# EAGLE design range_cape (EAGLE 7.1.0)

## Sheet 1 of 5
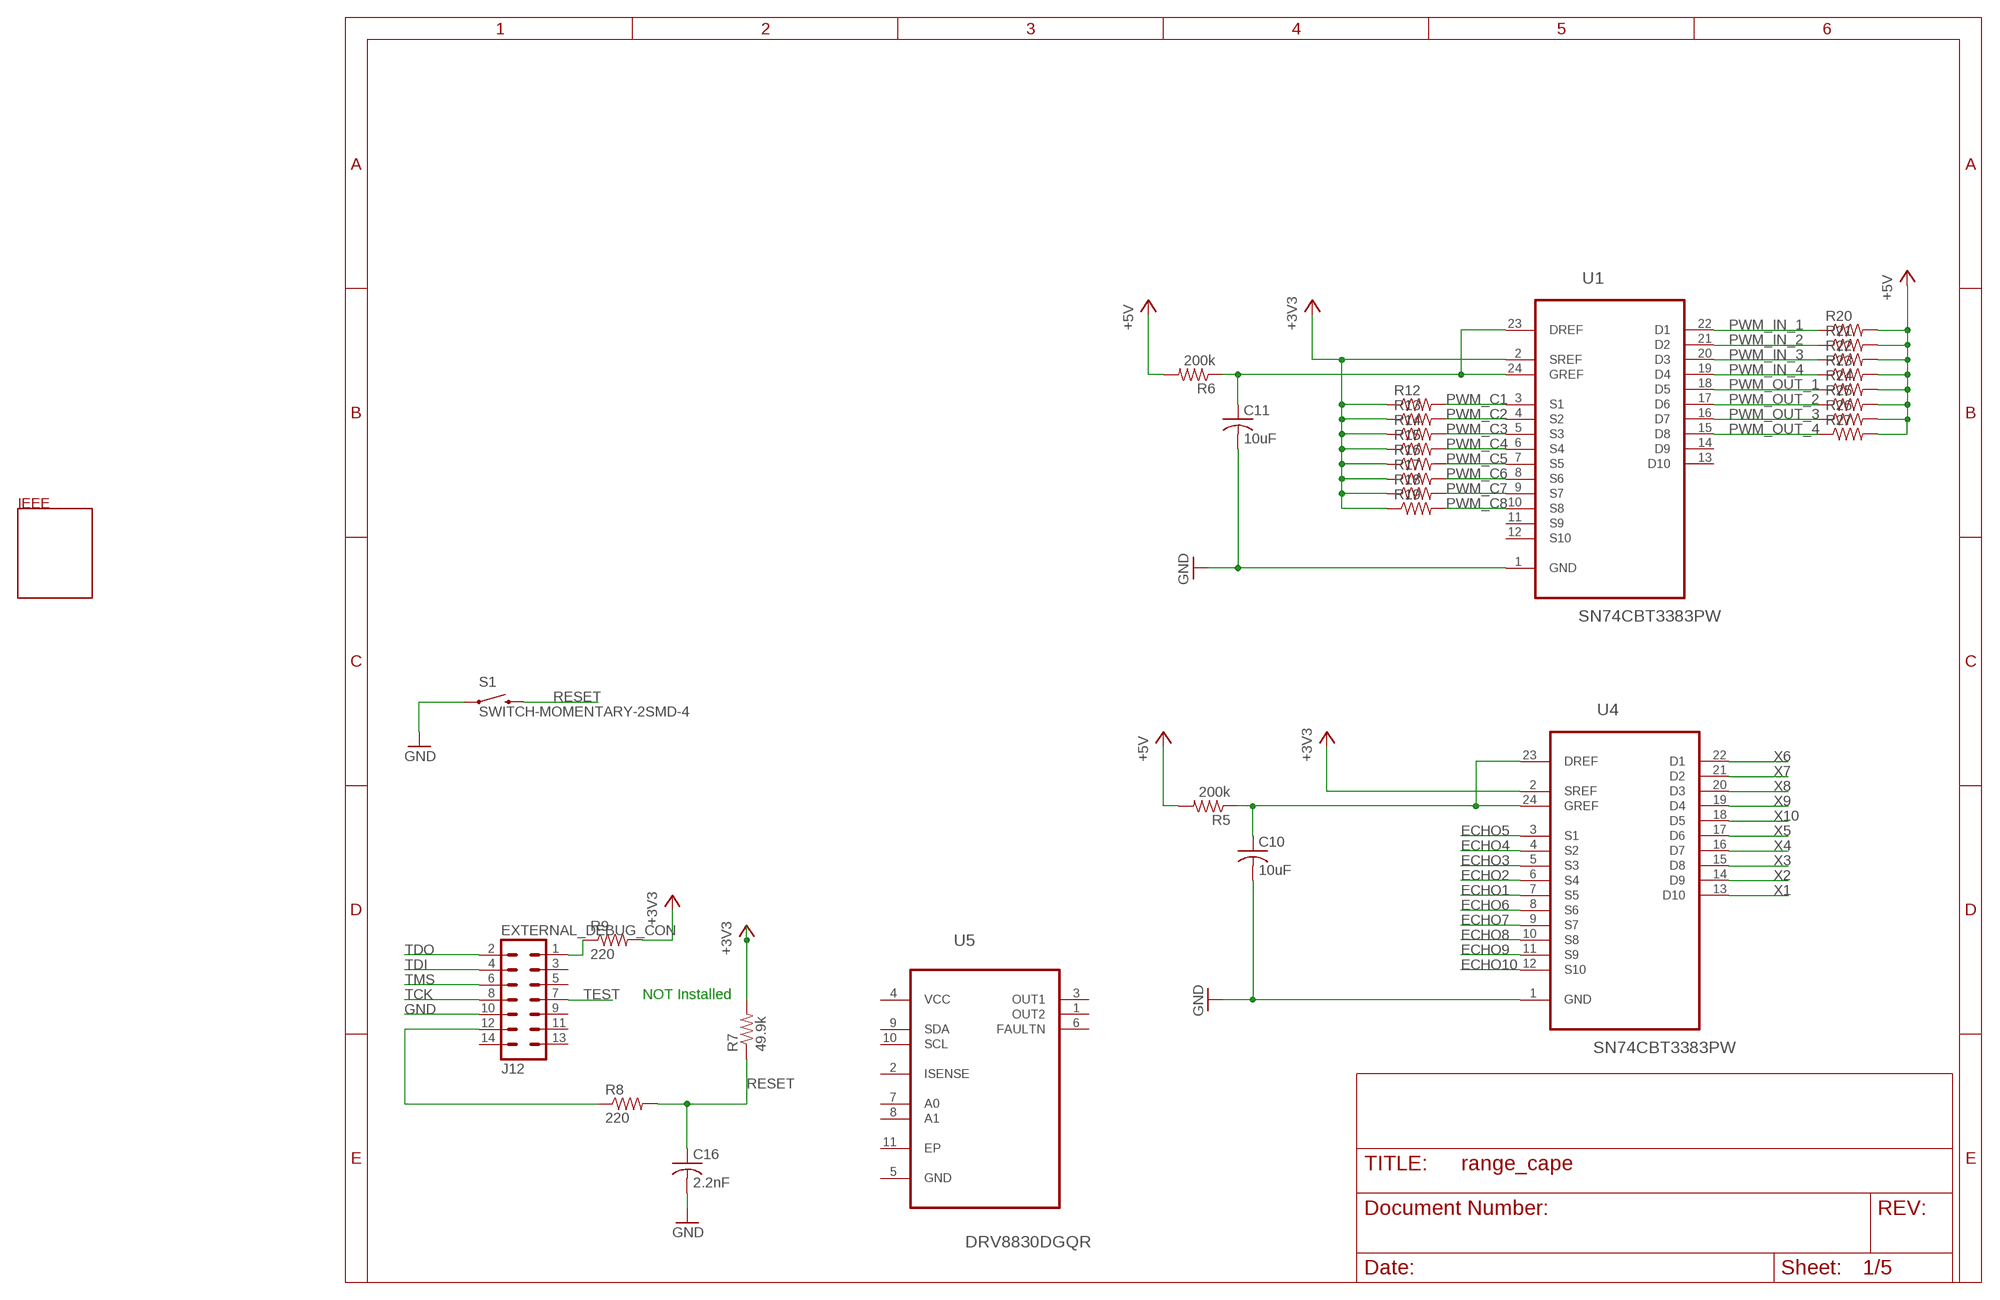
[diagram p0: schematic, sheet 1]

### Parts
C10  10uF  C-USC0805  [C0805]
C11  10uF  C-USC0805  [C0805]
C16  2.2nF  C-USC0603  [C0603]
J12  EXTERNAL_DEBUG_CON  [EXTERNAL_DEBUG]
R5  200k  R-US_R0603  [R0603]
R6  200k  R-US_R0603  [R0603]
R7  49.9k  R-US_R0603  [R0603]
R8  220  R-US_R0603  [R0603]
R9  220  R-US_R0603  [R0603]
R12  R-US_R0402  [R0402]
R13  R-US_R0402  [R0402]
R14  R-US_R0402  [R0402]
R15  R-US_R0402  [R0402]
R16  R-US_R0402  [R0402]
R17  R-US_R0402  [R0402]
R18  R-US_R0402  [R0402]
R19  R-US_R0402  [R0402]
R20  R-US_R0402  [R0402]
R21  R-US_R0402  [R0402]
R22  R-US_R0402  [R0402]
R23  R-US_R0402  [R0402]
R24  R-US_R0402  [R0402]
R25  R-US_R0402  [R0402]
R26  R-US_R0402  [R0402]
R27  R-US_R0402  [R0402]
S1  SWITCH-MOMENTARY-2SMD-4  [TACTILE_SWITCH_TALL]
U1  SN74CBT3383PW  [SOP65P640X120-24N]
U4  SN74CBT3383PW  [SOP65P640X120-24N]
U5  DRV8830DGQR  [SOP65P640X110-15N]
U$2  IEEE  [IEEE]

### Nets
+3V3: R7.2 R9.2 R12.1 R13.1 R14.1 R15.1 R16.1 R17.1 R18.1 R19.1 U1.2(SREF) U4.2(SREF) ; also sheet 2,4
+5V: R5.2 R6.2 R20.2 R21.2 R22.2 R23.2 R24.2 R25.2 R26.2 R27.2 ; also sheet 2,3,4
ECHO1: U4.7(S5)
ECHO2: U4.6(S4)
ECHO3: U4.5(S3)
ECHO4: U4.4(S2)
ECHO5: U4.3(S1)
ECHO6: U4.8(S6)
ECHO7: U4.9(S7)
ECHO8: U4.10(S8)
ECHO9: U4.11(S9)
ECHO10: U4.12(S10)
GND: C10.2 C11.2 C16.2 J12.10 S1.A2 U1.1(GND) U4.1(GND) ; also sheet 2,3,4,5
N$4: C11.1 R6.1 U1.23(DREF) U1.24(GREF)
N$8: J12.12 R8.1
N$9: J12.1 R9.1
N$12: C10.1 R5.1 U4.23(DREF) U4.24(GREF)
PWM_C1: R12.2 U1.3(S1)
PWM_C2: R13.2 U1.4(S2)
PWM_C3: R14.2 U1.5(S3)
PWM_C4: R15.2 U1.6(S4)
PWM_C5: R16.2 U1.7(S5)
PWM_C6: R17.2 U1.8(S6)
PWM_C7: R18.2 U1.9(S7)
PWM_C8: R19.2 U1.10(S8)
PWM_IN_1: R20.1 U1.22(D1) ; also sheet 3
PWM_IN_2: R21.1 U1.21(D2) ; also sheet 3
PWM_IN_3: R22.1 U1.20(D3) ; also sheet 3
PWM_IN_4: R23.1 U1.19(D4) ; also sheet 3
PWM_OUT_1: R24.1 U1.18(D5) ; also sheet 3
PWM_OUT_2: R25.1 U1.17(D6) ; also sheet 3
PWM_OUT_3: R26.1 U1.16(D7) ; also sheet 3
PWM_OUT_4: R27.1 U1.15(D8) ; also sheet 3
RESET: C16.1 R7.1 R8.2 S1.B2
TCK: J12.8
TDI: J12.4
TDO: J12.2
TEST: J12.7
TMS: J12.6
X1: U4.13(D10) ; also sheet 3
X2: U4.14(D9) ; also sheet 3
X3: U4.15(D8) ; also sheet 3
X4: U4.16(D7) ; also sheet 3
X5: U4.17(D6) ; also sheet 3
X6: U4.22(D1) ; also sheet 3
X7: U4.21(D2) ; also sheet 3
X8: U4.20(D3) ; also sheet 3
X9: U4.19(D4) ; also sheet 3
X10: U4.18(D5) ; also sheet 3
Unconnected: J12.3 J12.5 J12.9 J12.11 J12.13 J12.14 U1.11(S9) U1.12(S10) U1.13(D10) U1.14(D9) U5.1(OUT2) U5.2(ISENSE) U5.3(OUT1) U5.5(GND) U5.6(FAULTN) U5.7(A0) U5.8(A1) U5.9(SDA) U5.10(SCL) U5.11(EP)

### Notes on the sheet
- NOT Installed

## Sheet 2 of 5
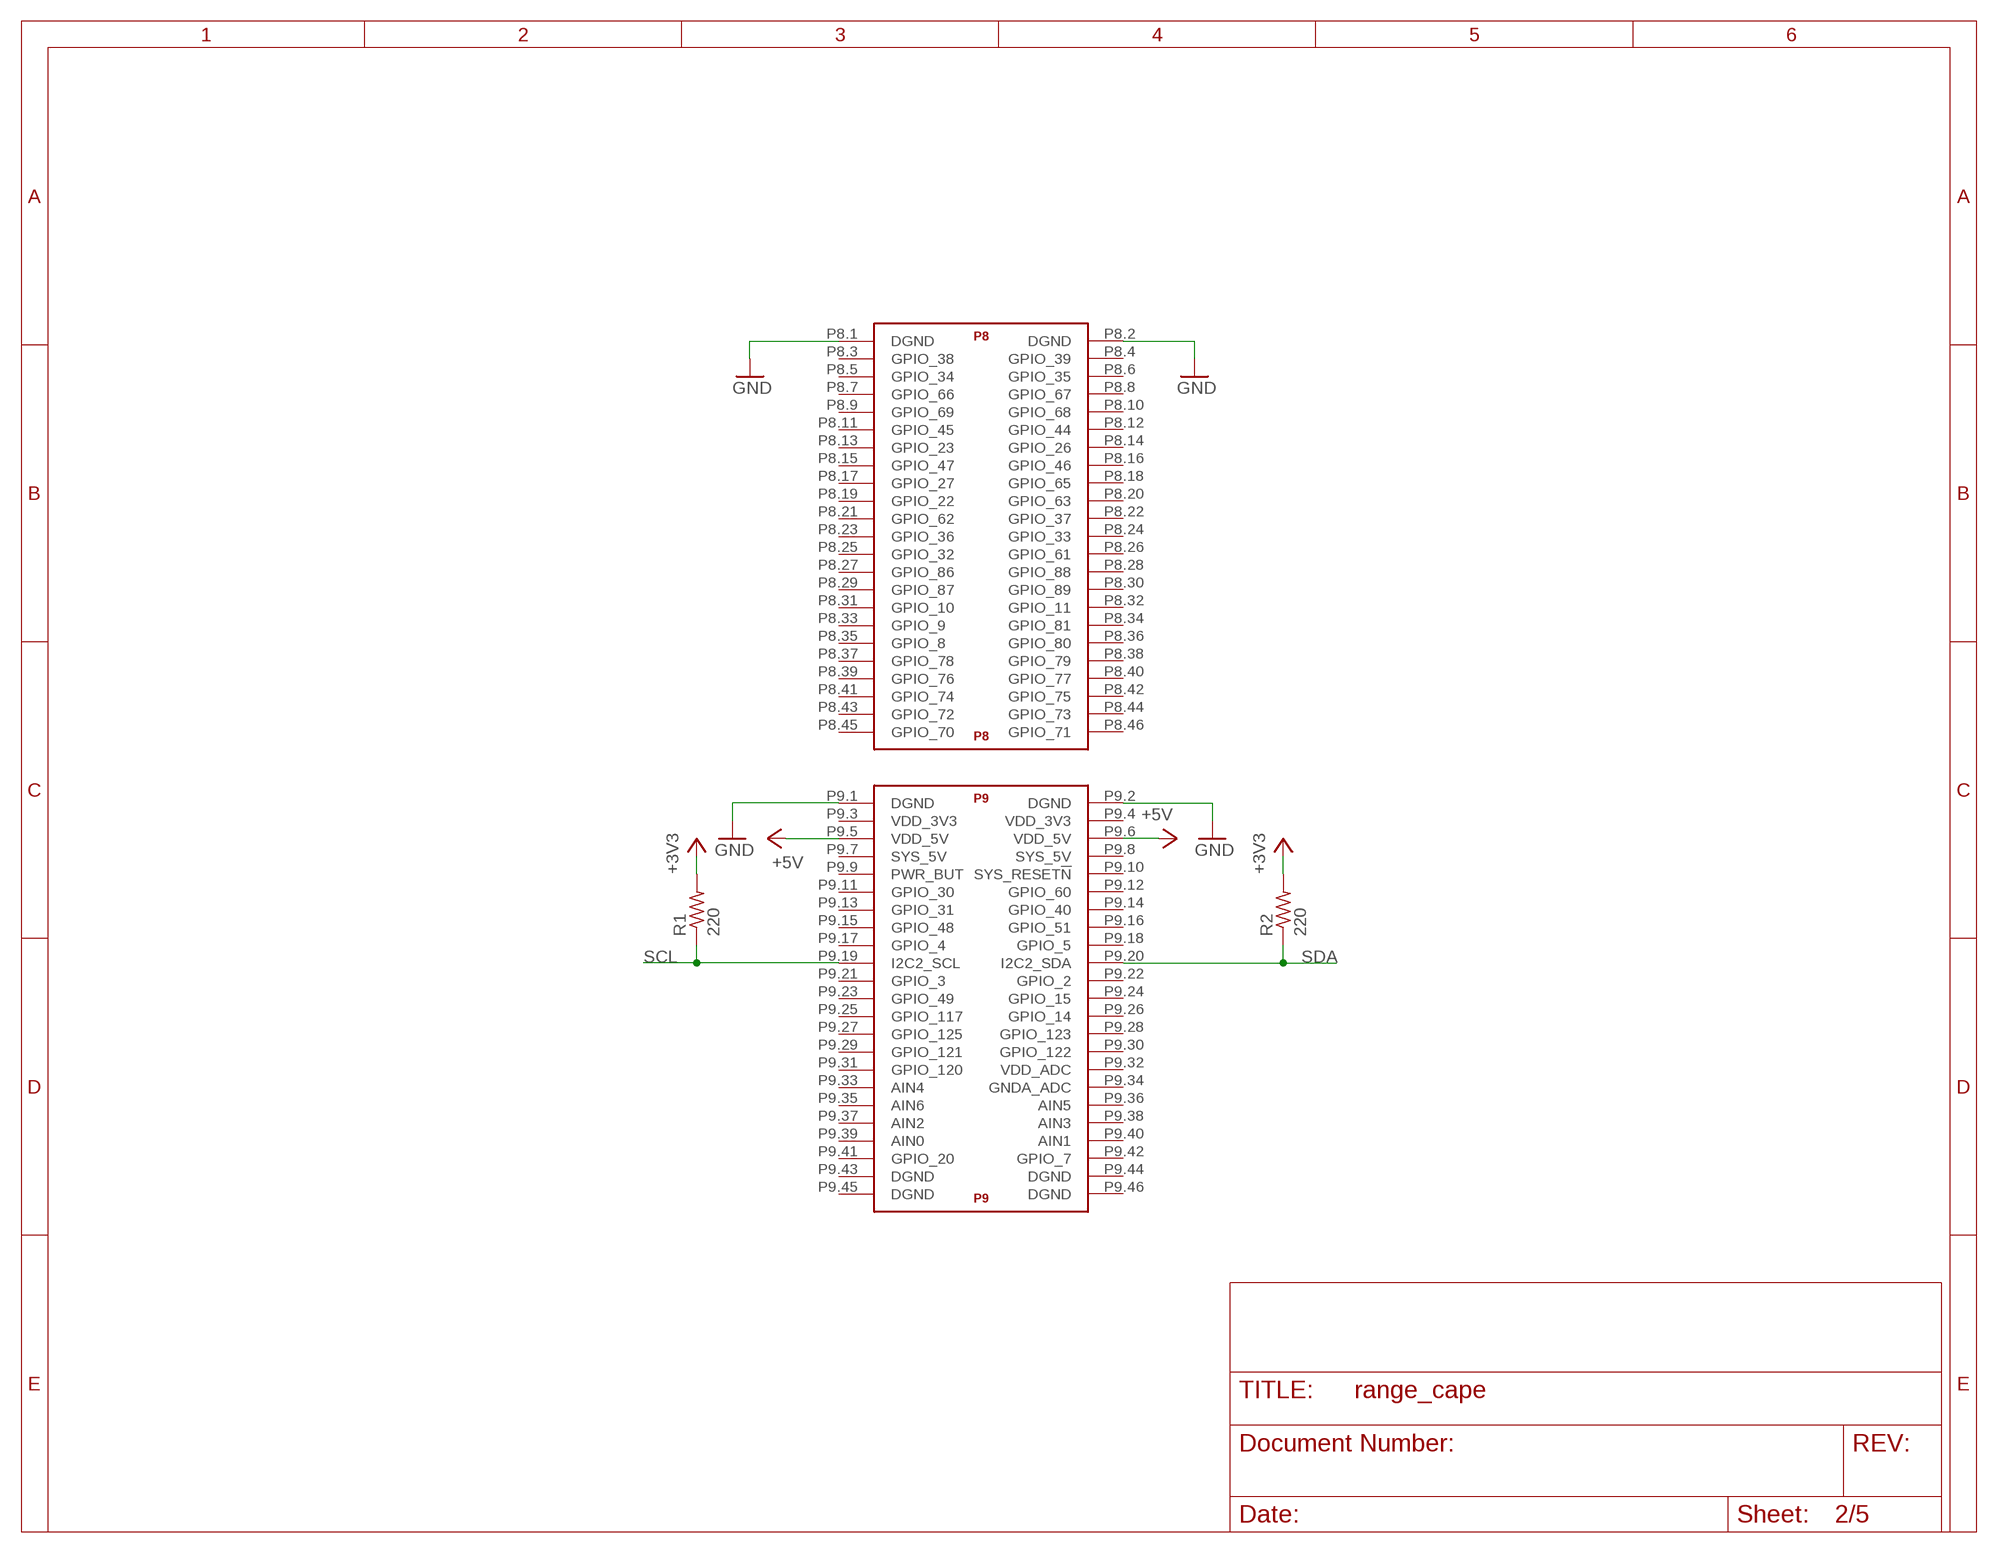
[diagram p1: schematic, sheet 2]

### Parts
R1  220  R-US_R0805W  [R0805W]
R2  220  R-US_R0805W  [R0805W]
U$1  BEAGLE_BONE_BLACK_CAPE  [BEAGLE_BONE_BLACK_CAPE]

### Nets
+3V3: R1.2 R2.2 ; also sheet 1,4
+5V: U$1.P9.5(P9:VDD_5V) U$1.P9.6(P9:VDD_5V) ; also sheet 1,3,4
GND: U$1.P8.1(P8:DGND) U$1.P8.2(P8:DGND) U$1.P9.1(P9:DGND) U$1.P9.2(P9:DGND) ; also sheet 1,3,4,5
SCL: R1.1 U$1.P9.19(P9:I2C2_SCL)
SDA: R2.1 U$1.P9.20(P9:I2C2_SDA)
Unconnected: U$1.P8.3(P8:GPIO_38) U$1.P8.4(P8:GPIO_39) U$1.P8.5(P8:GPIO_34) U$1.P8.6(P8:GPIO_35) U$1.P8.7(P8:GPIO_66) U$1.P8.8(P8:GPIO_67) U$1.P8.9(P8:GPIO_69) U$1.P8.10(P8:GPIO_68) U$1.P8.11(P8:GPIO_45) U$1.P8.12(P8:GPIO_44) U$1.P8.13(P8:GPIO_23) U$1.P8.14(P8:GPIO_26) U$1.P8.15(P8:GPIO_47) U$1.P8.16(P8:GPIO_46) U$1.P8.17(P8:GPIO_27) U$1.P8.18(P8:GPIO_65) U$1.P8.19(P8:GPIO_22) U$1.P8.20(P8:GPIO_63) U$1.P8.21(P8:GPIO_62) U$1.P8.22(P8:GPIO_37) U$1.P8.23(P8:GPIO_36) U$1.P8.24(P8:GPIO_33) U$1.P8.25(P8:GPIO_32) U$1.P8.26(P8:GPIO_61) U$1.P8.27(P8:GPIO_86) U$1.P8.28(P8:GPIO_88) U$1.P8.29(P8:GPIO_87) U$1.P8.30(P8:GPIO_89) U$1.P8.31(P8:GPIO_10) U$1.P8.32(P8:GPIO_11) U$1.P8.33(P8:GPIO_9) U$1.P8.34(P8:GPIO_81) U$1.P8.35(P8:GPIO_8) U$1.P8.36(P8:GPIO_80) U$1.P8.37(P8:GPIO_78) U$1.P8.38(P8:GPIO_79) U$1.P8.39(P8:GPIO_76) U$1.P8.40(P8:GPIO_77) U$1.P8.41(P8:GPIO_74) U$1.P8.42(P8:GPIO_75) U$1.P8.43(P8:GPIO_72) U$1.P8.44(P8:GPIO_73) U$1.P8.45(P8:GPIO_70) U$1.P8.46(P8:GPIO_71) U$1.P9.3(P9:VDD_3V3) U$1.P9.4(P9:VDD_3V3) U$1.P9.7(P9:SYS_5V) U$1.P9.8(P9:SYS_5V) U$1.P9.9(P9:PWR_BUT) U$1.P9.10(P9:SYS_RESET!N) U$1.P9.11(P9:GPIO_30) U$1.P9.12(P9:GPIO_60) U$1.P9.13(P9:GPIO_31) U$1.P9.14(P9:GPIO_40) U$1.P9.15(P9:GPIO_48) U$1.P9.16(P9:GPIO_51) U$1.P9.17(P9:GPIO_4) U$1.P9.18(P9:GPIO_5) U$1.P9.21(P9:GPIO_3) U$1.P9.22(P9:GPIO_2) U$1.P9.23(P9:GPIO_49) U$1.P9.24(P9:GPIO_15) U$1.P9.25(P9:GPIO_117) U$1.P9.26(P9:GPIO_14) U$1.P9.27(P9:GPIO_125) U$1.P9.28(P9:GPIO_123) U$1.P9.29(P9:GPIO_121) U$1.P9.30(P9:GPIO_122) U$1.P9.31(P9:GPIO_120) U$1.P9.32(P9:VDD_ADC) U$1.P9.33(P9:AIN4) U$1.P9.34(P9:GNDA_ADC) U$1.P9.35(P9:AIN6) U$1.P9.36(P9:AIN5) U$1.P9.37(P9:AIN2) U$1.P9.38(P9:AIN3) U$1.P9.39(P9:AIN0) U$1.P9.40(P9:AIN1) U$1.P9.41(P9:GPIO_20) U$1.P9.42(P9:GPIO_7) U$1.P9.43(P9:DGND) U$1.P9.44(P9:DGND) U$1.P9.45(P9:DGND) U$1.P9.46(P9:DGND)

## Sheet 3 of 5
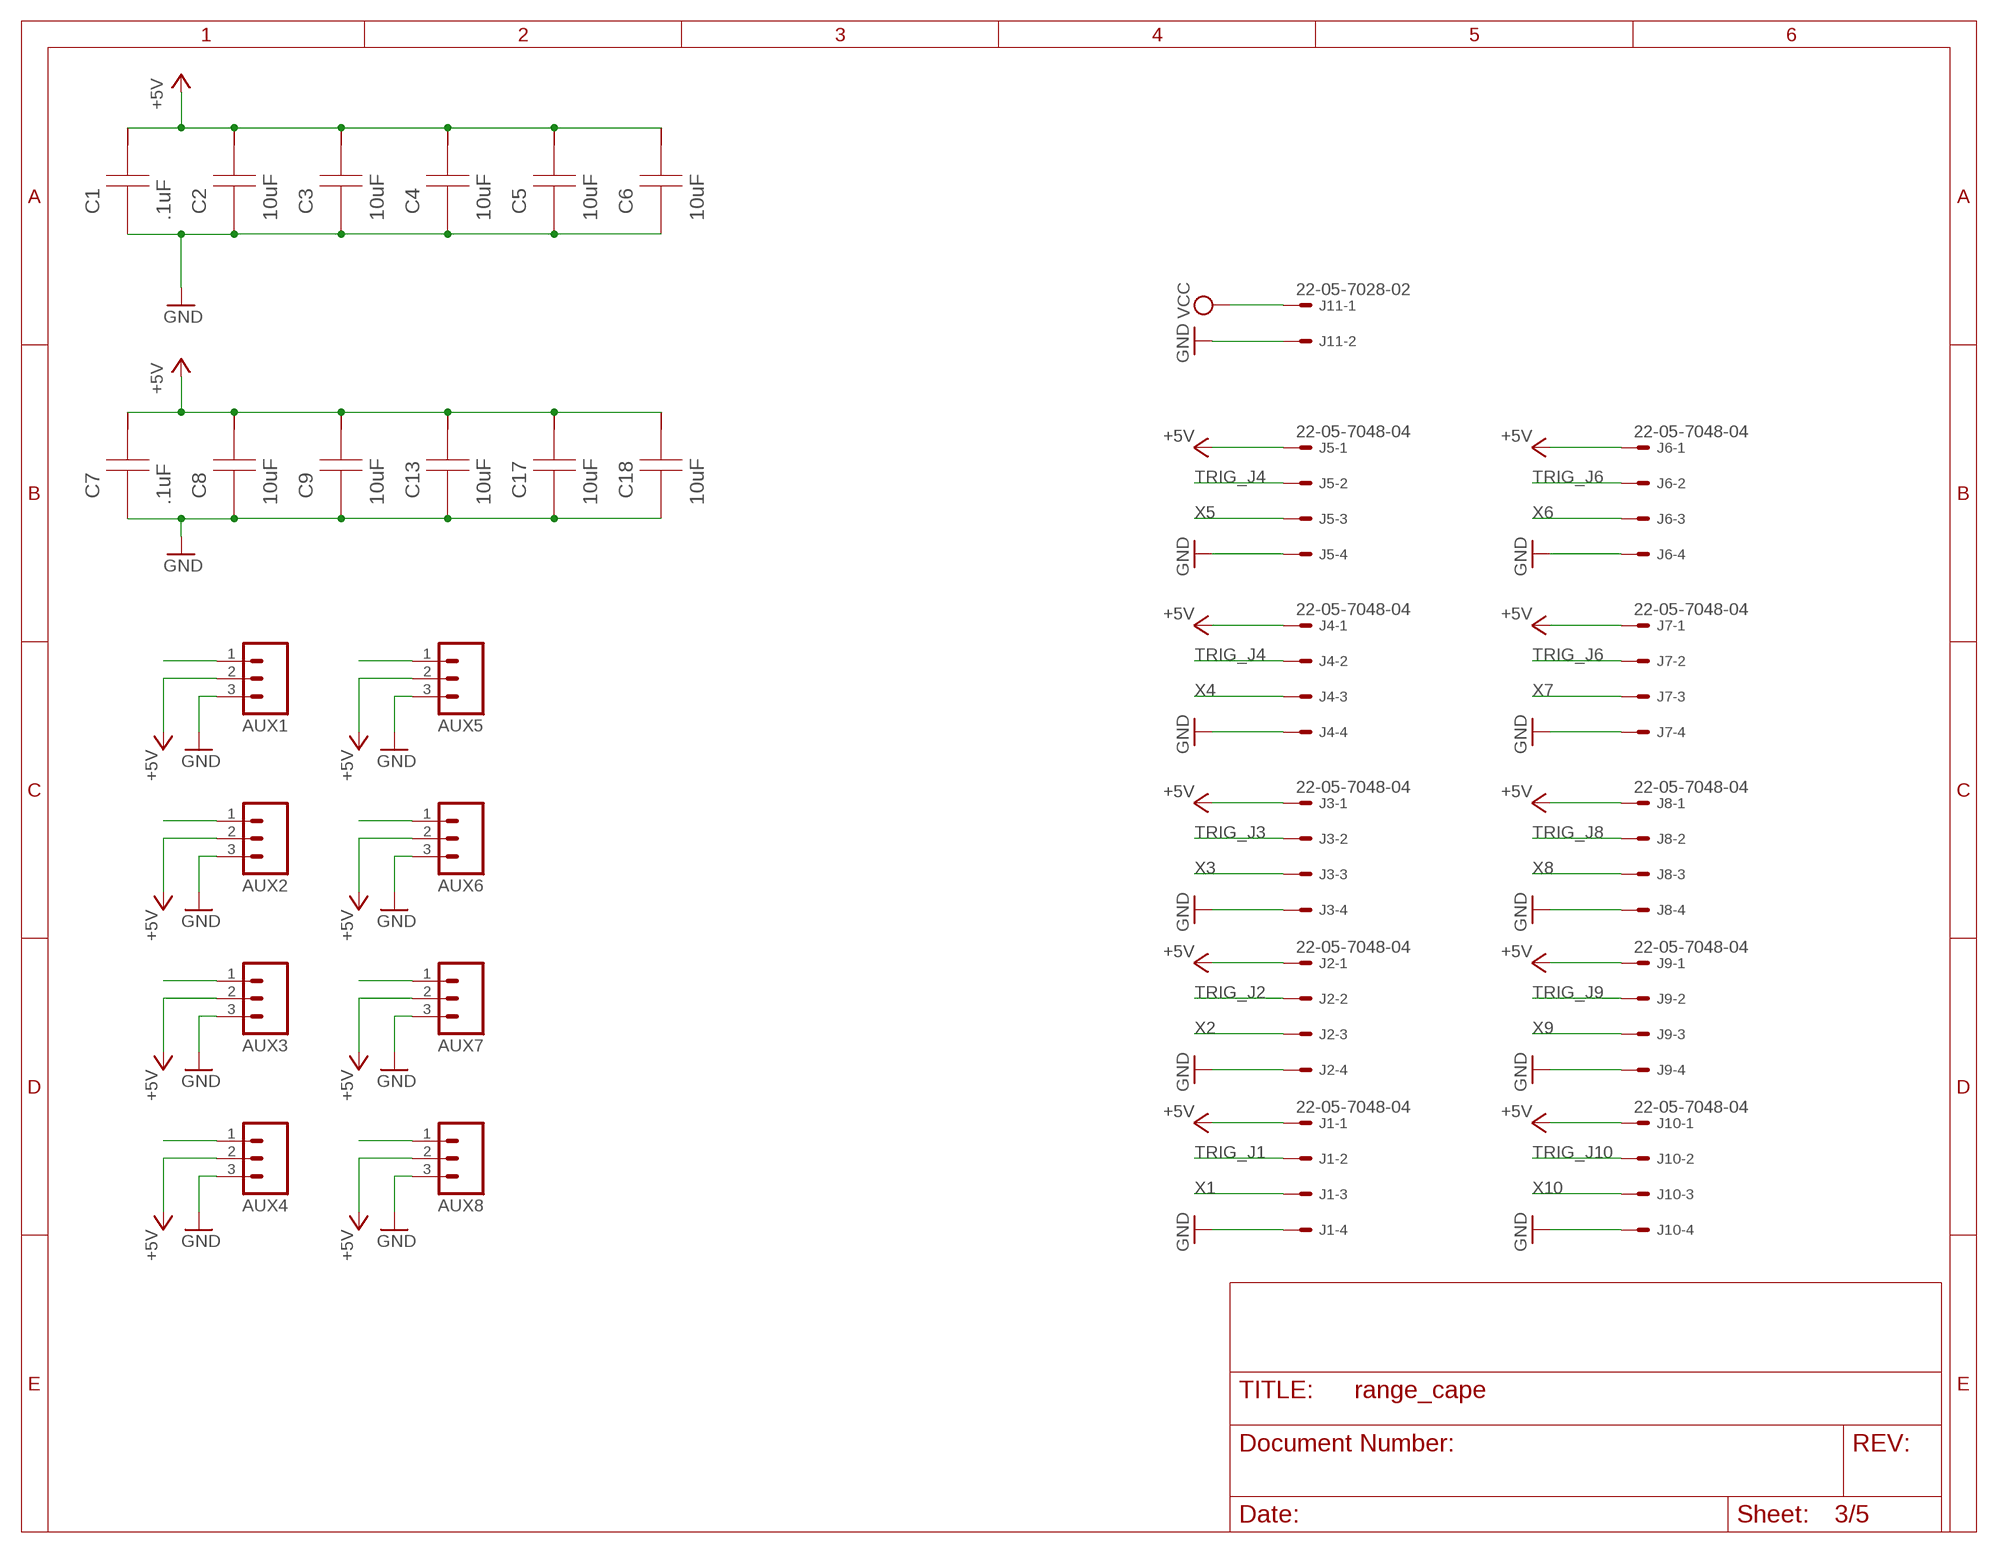
[diagram p2: schematic, sheet 3]

### Parts
AUX1  M03LOCK  [1X03_LOCK]
AUX2  M03LOCK  [1X03_LOCK]
AUX3  M03LOCK  [1X03_LOCK]
AUX4  M03LOCK  [1X03_LOCK]
AUX5  M03LOCK  [1X03_LOCK]
AUX6  M03LOCK  [1X03_LOCK]
AUX7  M03LOCK  [1X03_LOCK]
AUX8  M03LOCK  [1X03_LOCK]
C1  .1uF  C3216X5R1A106K  [1206]
C2  10uF  C3216X5R1A106K  [1206]
C3  10uF  C3216X5R1A106K  [1206]
C4  10uF  C3216X5R1A106K  [1206]
C5  10uF  C3216X5R1A106K  [1206]
C6  10uF  C3216X5R1A106K  [1206]
C7  .1uF  C3216X5R1A106K  [1206]
C8  10uF  C3216X5R1A106K  [1206]
C9  10uF  C3216X5R1A106K  [1206]
C13  10uF  C3216X5R1A106K  [1206]
C17  10uF  C3216X5R1A106K  [1206]
C18  10uF  C3216X5R1A106K  [1206]
J1  22-05-7048-04  [7395-04]
J2  22-05-7048-04  [7395-04]
J3  22-05-7048-04  [7395-04]
J4  22-05-7048-04  [7395-04]
J5  22-05-7048-04  [7395-04]
J6  22-05-7048-04  [7395-04]
J7  22-05-7048-04  [7395-04]
J8  22-05-7048-04  [7395-04]
J9  22-05-7048-04  [7395-04]
J10  22-05-7048-04  [7395-04]
J11  22-05-7028-02  [7395-02]

### Nets
+5V: AUX1.2 AUX2.2 AUX3.2 AUX4.2 AUX5.2 AUX6.2 AUX7.2 AUX8.2 C1.1 C2.1 C3.1 C4.1 C5.1 C6.1 C7.1 C8.1 C9.1 C13.1 C17.1 C18.1 J1.1 J2.1 J3.1 J4.1 J5.1 J6.1 J7.1 J8.1 J9.1 J10.1 ; also sheet 1,2,4
GND: AUX1.3 AUX2.3 AUX3.3 AUX4.3 AUX5.3 AUX6.3 AUX7.3 AUX8.3 C1.2 C2.2 C3.2 C4.2 C5.2 C6.2 C7.2 C8.2 C9.2 C13.2 C17.2 C18.2 J1.4 J2.4 J3.4 J4.4 J5.4 J6.4 J7.4 J8.4 J9.4 J10.4 J11.2 ; also sheet 1,2,4,5
PWM_IN_1: AUX1.1 ; also sheet 1
PWM_IN_2: AUX2.1 ; also sheet 1
PWM_IN_3: AUX3.1 ; also sheet 1
PWM_IN_4: AUX4.1 ; also sheet 1
PWM_OUT_1: AUX5.1 ; also sheet 1
PWM_OUT_2: AUX6.1 ; also sheet 1
PWM_OUT_3: AUX7.1 ; also sheet 1
PWM_OUT_4: AUX8.1 ; also sheet 1
TRIG_J1: J1.2
TRIG_J2: J2.2
TRIG_J3: J3.2
TRIG_J4: J4.2 J5.2
TRIG_J6: J6.2 J7.2
TRIG_J8: J8.2
TRIG_J9: J9.2
TRIG_J10: J10.2
VCC: J11.1 ; also sheet 4
X1: J1.3 ; also sheet 1
X2: J2.3 ; also sheet 1
X3: J3.3 ; also sheet 1
X4: J4.3 ; also sheet 1
X5: J5.3 ; also sheet 1
X6: J6.3 ; also sheet 1
X7: J7.3 ; also sheet 1
X8: J8.3 ; also sheet 1
X9: J9.3 ; also sheet 1
X10: J10.3 ; also sheet 1

## Sheet 4 of 5
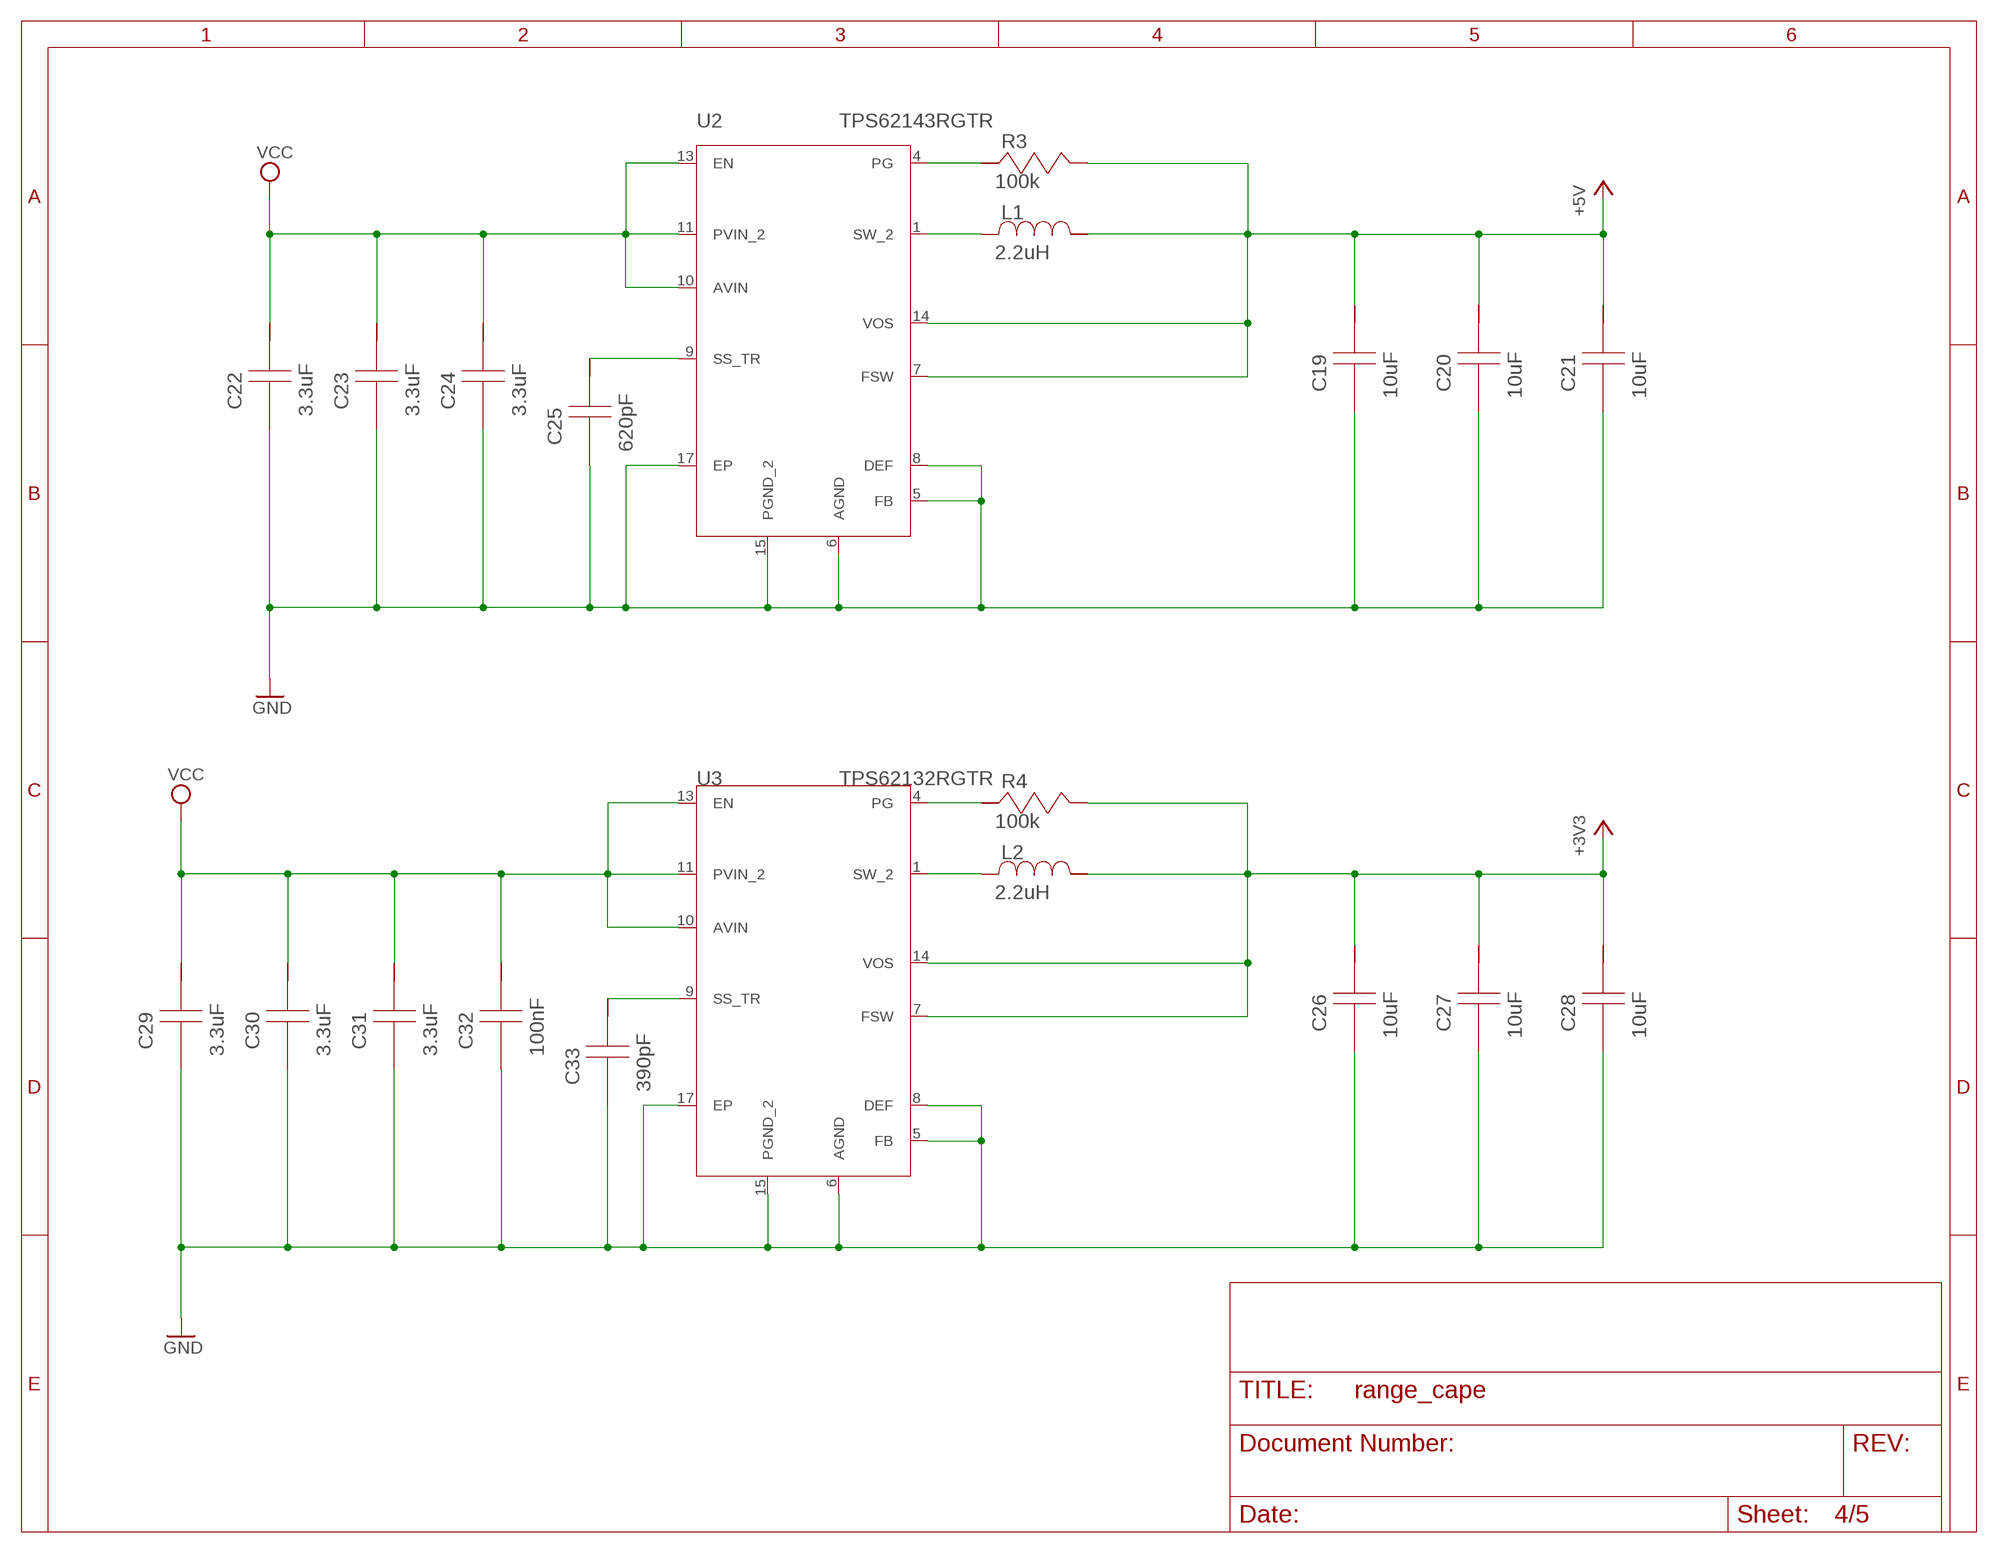
[diagram p3: schematic, sheet 4]

### Parts
C19  10uF  C3216X5R1A106K  [1206]
C20  10uF  C3216X5R1A106K  [1206]
C21  10uF  C3216X5R1A106K  [1206]
C22  3.3uF  C3216X7R1E335K  [C3216X7R1E335K]
C23  3.3uF  C3216X7R1E335K  [C3216X7R1E335K]
C24  3.3uF  C3216X7R1E335K  [C3216X7R1E335K]
C25  620pF  GRM1555C1E621JA01D  [0402]
C26  10uF  C3216X5R1A106K  [1206]
C27  10uF  C3216X5R1A106K  [1206]
C28  10uF  C3216X5R1A106K  [1206]
C29  3.3uF  C3216X7R1E335K  [C3216X7R1E335K]
C30  3.3uF  C3216X7R1E335K  [C3216X7R1E335K]
C31  3.3uF  C3216X7R1E335K  [C3216X7R1E335K]
C32  100nF  C0603C104K3RACTU  [0603]
C33  390pF  08055C391KAT2A  [0805]
L1  2.2uH  IHLP1212BZER2R2M11  [IHLP-1212BZ]
L2  2.2uH  IHLP1212BZER2R2M11  [IHLP-1212BZ]
R3  100k  CRCW0402100KFKED  [CRCW0402100KFKED]
R4  100k  CRCW0402100KFKED  [CRCW0402100KFKED]
U2  TPS62143RGTR  [S-PVQFN-N16]
U3  TPS62132RGTR  [S-PVQFN-N16]

### Nets
+3V3: C26.1 C27.1 C28.1 L2.2 R4.1 U3.7(FSW) U3.14(VOS) ; also sheet 1,2
+5V: C19.1 C20.1 C21.1 L1.2 R3.1 U2.7(FSW) U2.14(VOS) ; also sheet 1,2,3
GND: C19.2 C20.2 C21.2 C22.2 C23.2 C24.2 C25.2 C26.2 C27.2 C28.2 C29.2 C30.2 C31.2 C32.2 C33.2 U2.5(FB) U2.6(AGND) U2.8(DEF) U2.15(PGND_2) U2.17(EP) U3.5(FB) U3.6(AGND) U3.8(DEF) U3.15(PGND_2) U3.17(EP) ; also sheet 1,2,3,5
N$2: L2.1 U3.1(SW_2)
N$5: L1.1 U2.1(SW_2)
N$7: C25.1 U2.9(SS_TR)
N$14: R3.2 U2.4(PG)
N$15: R4.2 U3.4(PG)
N$20: C33.1 U3.9(SS_TR)
VCC: C22.1 C23.1 C24.1 C29.1 C30.1 C31.1 C32.1 U2.10(AVIN) U2.11(PVIN_2) U2.13(EN) U3.10(AVIN) U3.11(PVIN_2) U3.13(EN) ; also sheet 3

## Sheet 5 of 5
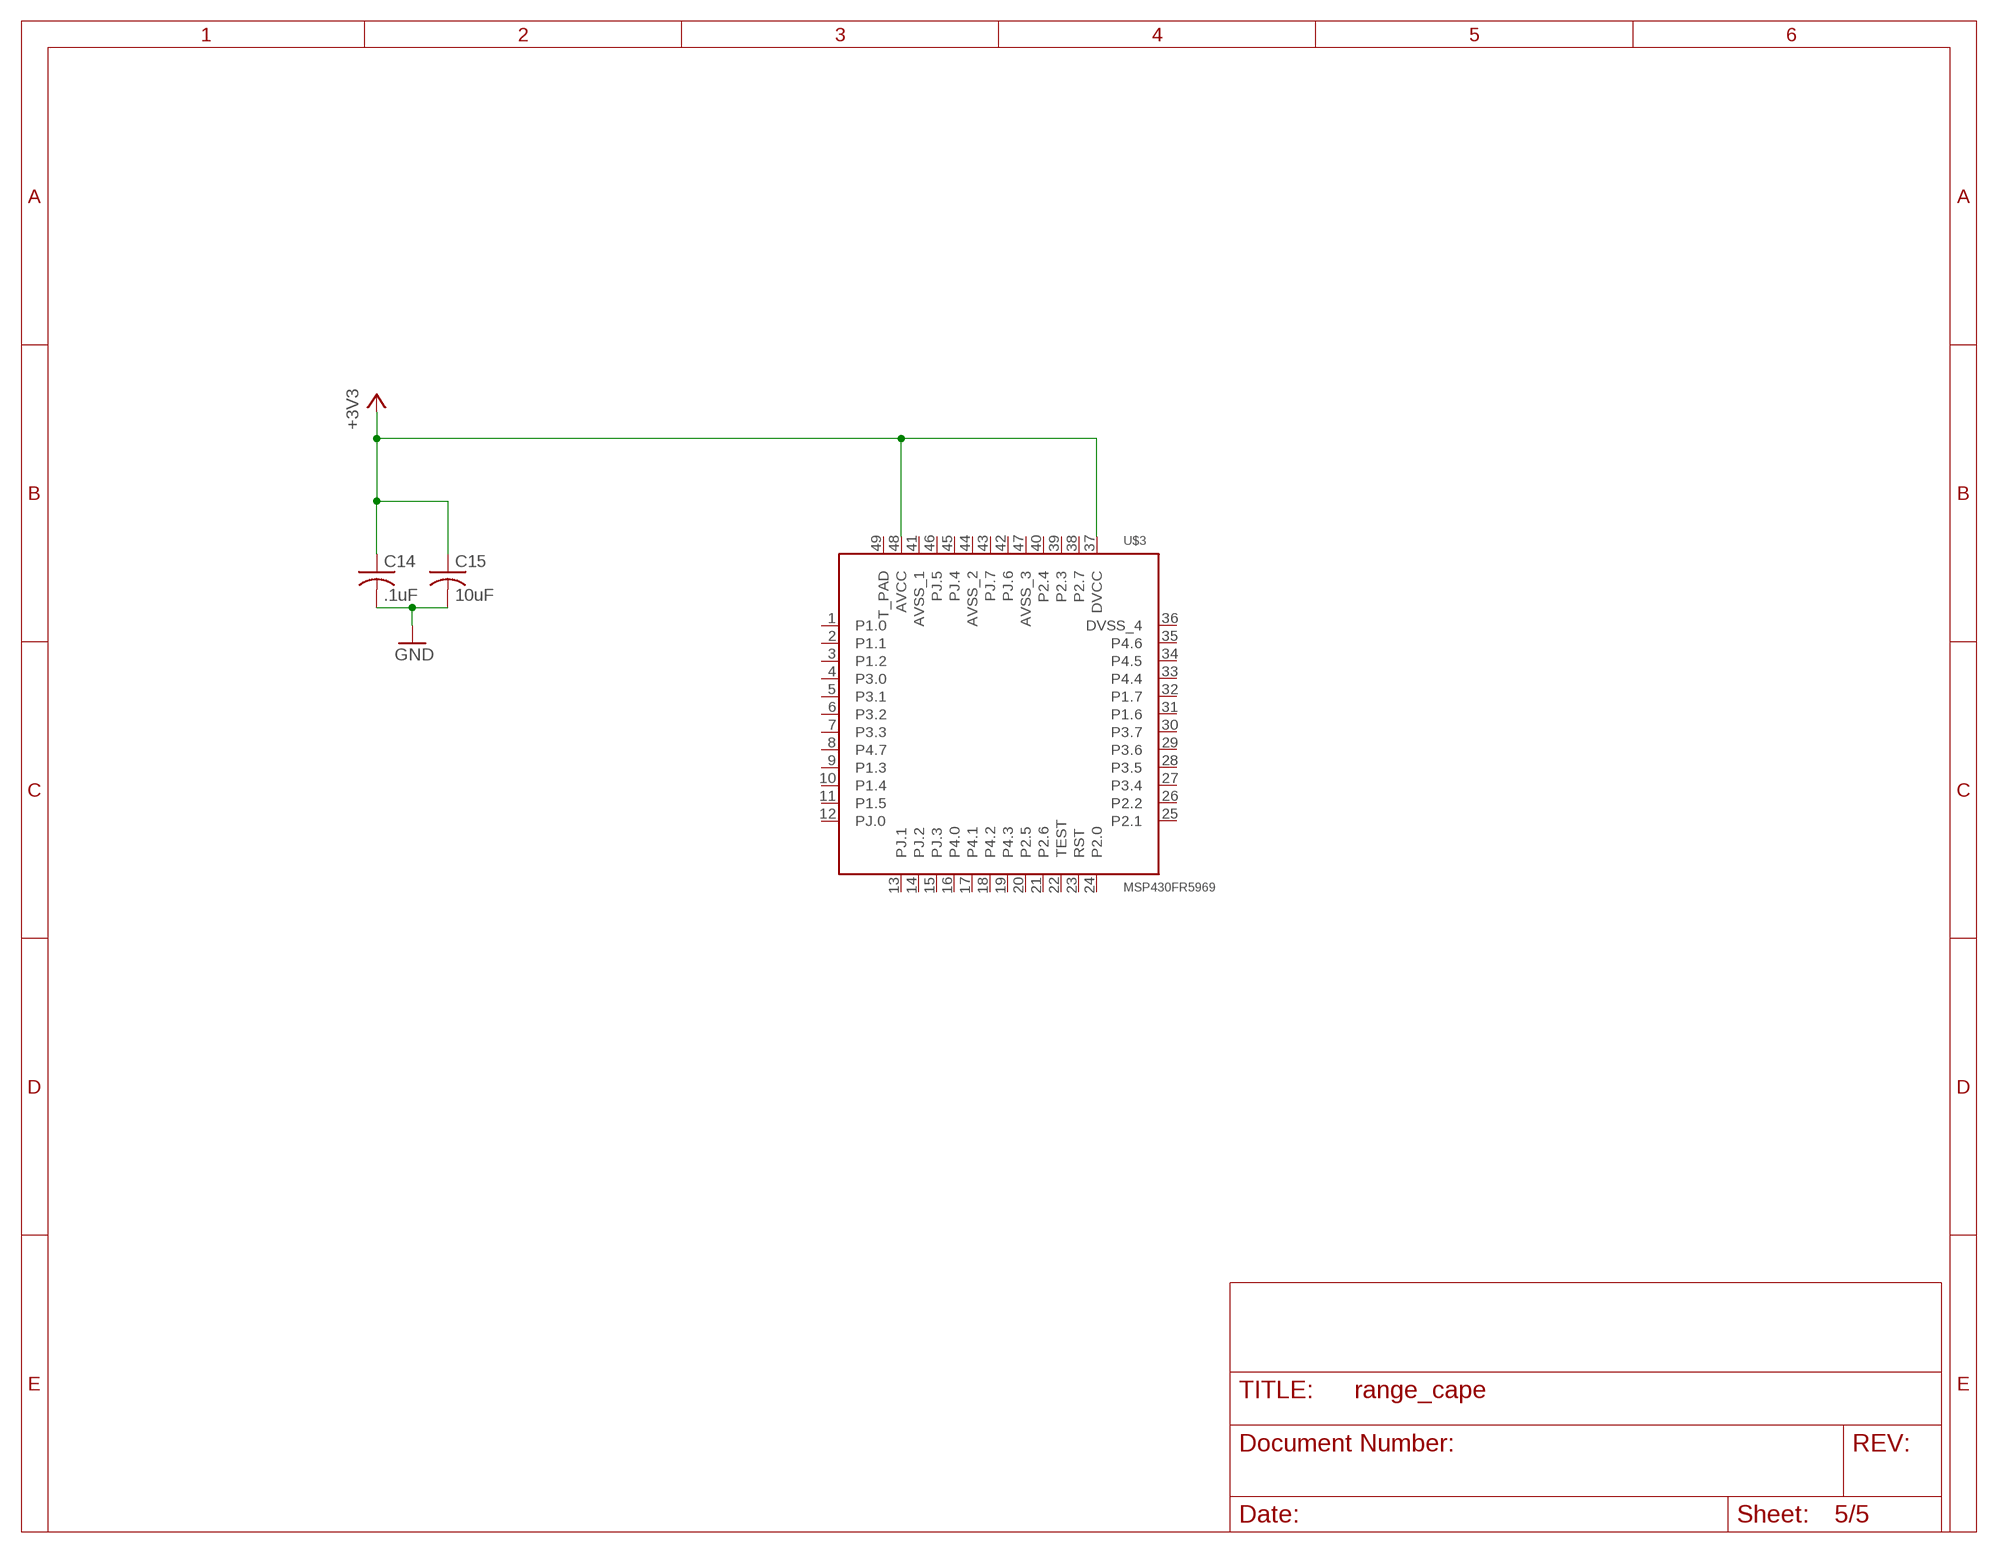
[diagram p4: schematic, sheet 5]

### Parts
C14  .1uF  C-USC0805  [C0805]
C15  10uF  C-USC0805  [C0805]
U$3  MSP430FR5969  [QFN50P700X700X100-49N]

### Nets
DVCC: C14.1 C15.1 U$3.37(DVCC) U$3.48(AVCC) ; supply symbol labelled +3V3
GND: C14.2 C15.2 ; also sheet 1,2,3,4
Unconnected: U$3.1(P1.0) U$3.2(P1.1) U$3.3(P1.2) U$3.4(P3.0) U$3.5(P3.1) U$3.6(P3.2) U$3.7(P3.3) U$3.8(P4.7) U$3.9(P1.3) U$3.10(P1.4) U$3.11(P1.5) U$3.12(PJ.0) U$3.13(PJ.1) U$3.14(PJ.2) U$3.15(PJ.3) U$3.16(P4.0) U$3.17(P4.1) U$3.18(P4.2) U$3.19(P4.3) U$3.20(P2.5) U$3.21(P2.6) U$3.22(TEST) U$3.23(RST) U$3.24(P2.0) U$3.25(P2.1) U$3.26(P2.2) U$3.27(P3.4) U$3.28(P3.5) U$3.29(P3.6) U$3.30(P3.7) U$3.31(P1.6) U$3.32(P1.7) U$3.33(P4.4) U$3.34(P4.5) U$3.35(P4.6) U$3.36(DVSS_4) U$3.38(P2.7) U$3.39(P2.3) U$3.40(P2.4) U$3.41(AVSS_1) U$3.42(PJ.6) U$3.43(PJ.7) U$3.44(AVSS_2) U$3.45(PJ.4) U$3.46(PJ.5) U$3.47(AVSS_3) U$3.49(T_PAD)

## Power pins joined to a net without a drawn wire
VCC: U5.4(VCC)

## Library data of the parts
AUX1-AUX8 = SparkFun-Connectors:M03: Header 3 Standard 3-pin 0.1" header. Use with straight break away headers (SKU : PRT-00116), right angle break away headers (PRT-00553), swiss pins (PRT-00743), machine pins (PRT-00117), and female headers (PRT-00115). Molex polarized connector foot print use with SKU : PRT-08232 with associated crimp pins and housings.
C1-C9 C13 C17 C18 = 3-3_fixed:C3216X5R1A106K; CAP: 1.0E-5; DATASHEETURL: http://www.tdk.co.jp/tefe02/e3999%5Fc.pdf; ESR: 0.00306; IRMS: 0.0; MANUFACTURER_PART_NUMBER: C3216X5R1A106K; VDC: 10.0; VENDOR: TDK
C10 C11 C14-C16 = rcl:C-US: CAPACITOR, American symbol
C19-C21 C26-C28 = 5v_fixed:C3216X5R1A106K; CAP: 1.0E-5; DATASHEETURL: http://www.tdk.co.jp/tefe02/e3999%5Fc.pdf; ESR: 0.00306; IRMS: 0.0; MANUFACTURER_PART_NUMBER: C3216X5R1A106K; VDC: 10.0; VENDOR: TDK
C22-C24 C29-C31 = 5v_fixed:C3216X7R1E335K; CAP: 3.3E-6; DATASHEETURL: http://www.tdk.co.jp/tefe02/e4187%5Fc.pdf; ESR: 0.004035; IRMS: 0.0; MANUFACTURER_PART_NUMBER: C3216X7R1E335K; VDC: 25.0; VENDOR: TDK
C25 = 5v_fixed:GRM1555C1E621JA01D; CAP: 6.2E-10; ESR: 0.0; IRMS: 0.0; MANUFACTURER_PART_NUMBER: GRM1555C1E621JA01D; VDC: 25.0; VENDOR: MuRata
C32 = 3-3_fixed:C0603C104K3RACTU; CAP: 1.0E-7; ESR: 0.0; IRMS: 0.0; MANUFACTURER_PART_NUMBER: C0603C104K3RACTU; VDC: 25.0; VENDOR: Kemet
C33 = 3-3_fixed:08055C391KAT2A; CAP: 3.9E-10; ESR: 0.509; IRMS: 0.0; MANUFACTURER_PART_NUMBER: 08055C391KAT2A; VDC: 50.0; VENDOR: AVX
J1-J10 = con-molex:22-?-04: CONNECTOR wire to board 2.54 mm (.1 inch) pitch header; OC_FARNELL: unknown; OC_NEWARK: unknown
J11 = con-molex:22-?-02: CONNECTOR wire to board 2.54 mm (.1 inch) pitch header; OC_FARNELL: 9731601; OC_NEWARK: unknown
J12 = jtag_interface:EXTERNAL_DEBUG_CON
L1 L2 = 5v_fixed:IHLP1212BZER2R2M11; DATASHEETURL: http://www.vishay.com/docs/34289/lp12bz11.pdf; DCR: 46.0; DESCRIPTION: Unknown; IDC: 3.0; L: 2.2E-6; MANUFACTURER: Vishay; MANUFACTURER_PART_NUMBER: IHLP1212BZER2R2M11; PACKAGE_DESIGNATOR: IHLP-1212BZ; VENDOR: Vishay-Dale
R1 R2 R5-R9 R12-R27 = rcl:R-US_: RESISTOR, American symbol
R3 R4 = 5v_fixed:CRCW0402100KFKED; MANUFACTURER_PART_NUMBER: CRCW0402100KFKED; POWER: 0.063; RESISTANCE: 100000.0; TOLERANCE: 1.0; VENDOR: Vishay-Dale
S1 = SparkFun-Electromechanical:SWITCH-MOMENTARY-2: Various NO switches- pushbuttons, reed, etc; PROD_ID: SWCH-11966
U1 U4 = range_cape:SN74CBT3383PW: 10-BIT FET BUS-EXCHANGE SWITCHES; MPN: SN74CBT3383PW; OC_FARNELL: 1741489; OC_NEWARK: 50R6333; PACKAGE: TSSOP-24; SUPPLIER: Texas Instruments
U2 = 5v_fixed:TPS62143RGTR; DATASHEETURL: http://www.ti.com/product/tps62131; FREQUENCY: 2500000.0; IMAX: 3.0; MANUFACTURER_PART_NUMBER: TPS62131RGTR; MKTG_PACKAGE: S-PVQFN-N16; NSID: TPS62131RGTR; PACKAGE: S-PVQFN-N16; VENDOR: Texas Instruments
U3 = 3-3_fixed:TPS62132RGTR; DATASHEETURL: http://www.ti.com/product/tps62131; FREQUENCY: 2500000.0; IMAX: 3.0; MANUFACTURER_PART_NUMBER: TPS62131RGTR; MKTG_PACKAGE: S-PVQFN-N16; NSID: TPS62131RGTR; PACKAGE: S-PVQFN-N16; VENDOR: Texas Instruments
U5 = Texas Instruments_By_element14_Batch_1:DRV8830DGQR: LOW-VOLTAGE MOTOR DRIVER WITH SERIAL INTERFACE; MPN: DRV8830DGQR; OC_FARNELL: 1863106; OC_NEWARK: 58T1482; PACKAGE: MSOP-10; SUPPLIER: TEXAS INSTRUMENTS
U$1 = SparkFun-Boards:BEAGLE_BONE_BLACK_CAPE
U$2 = TIparts:IEEE
U$3 = range_cape:MSP430FR5969

## Board
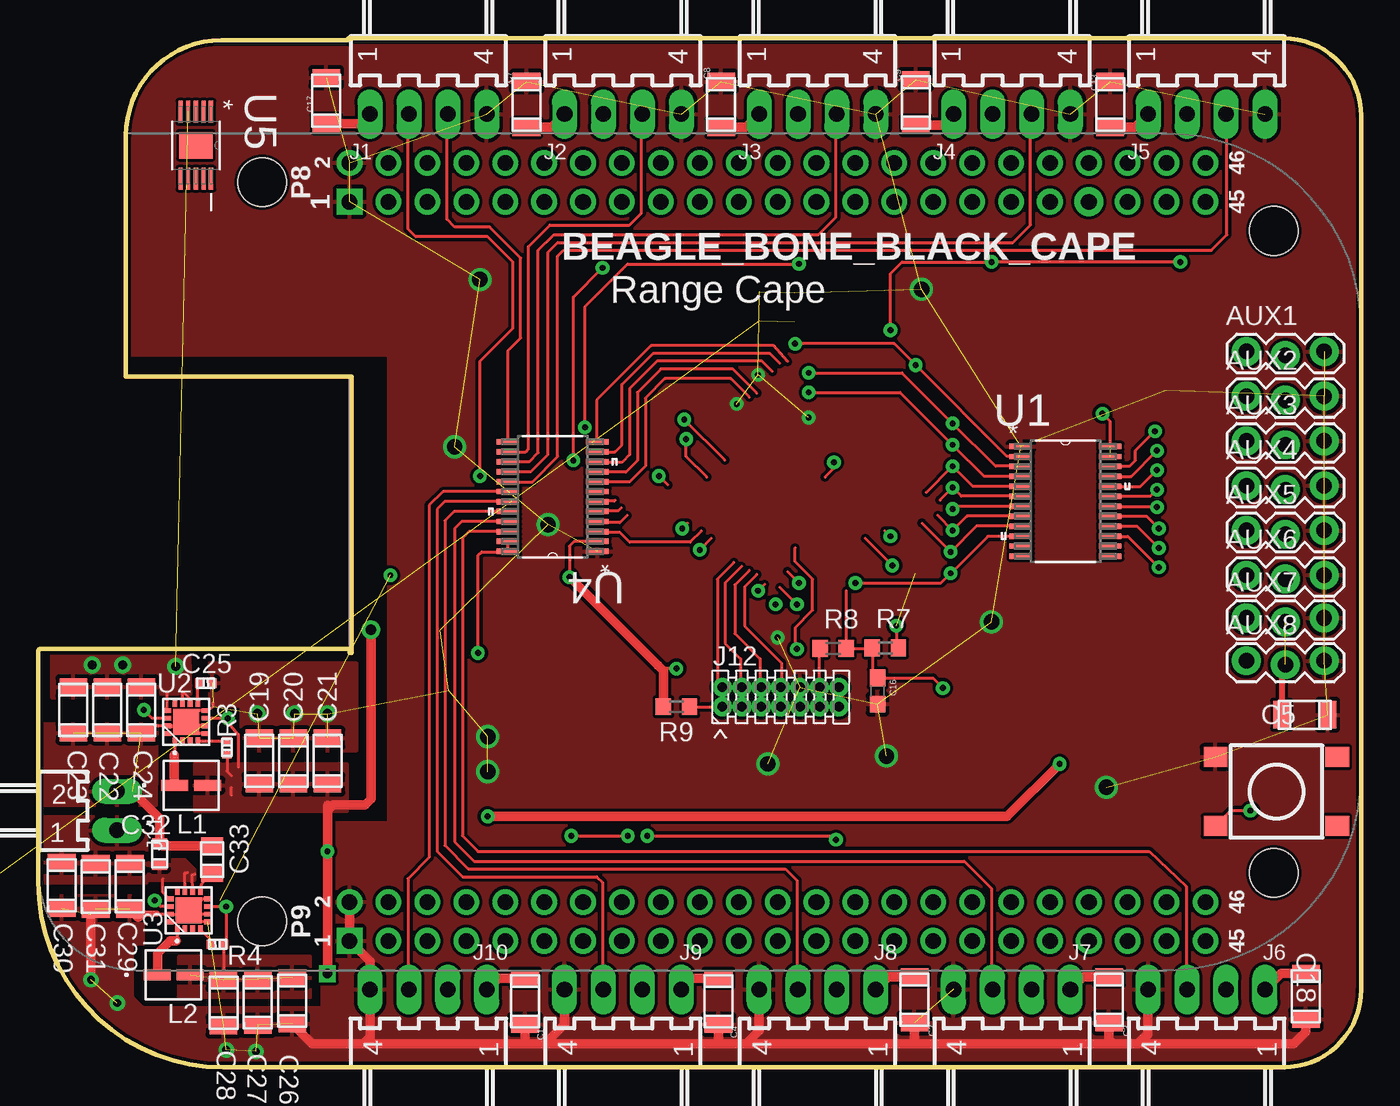
[diagram p5: board, top side]
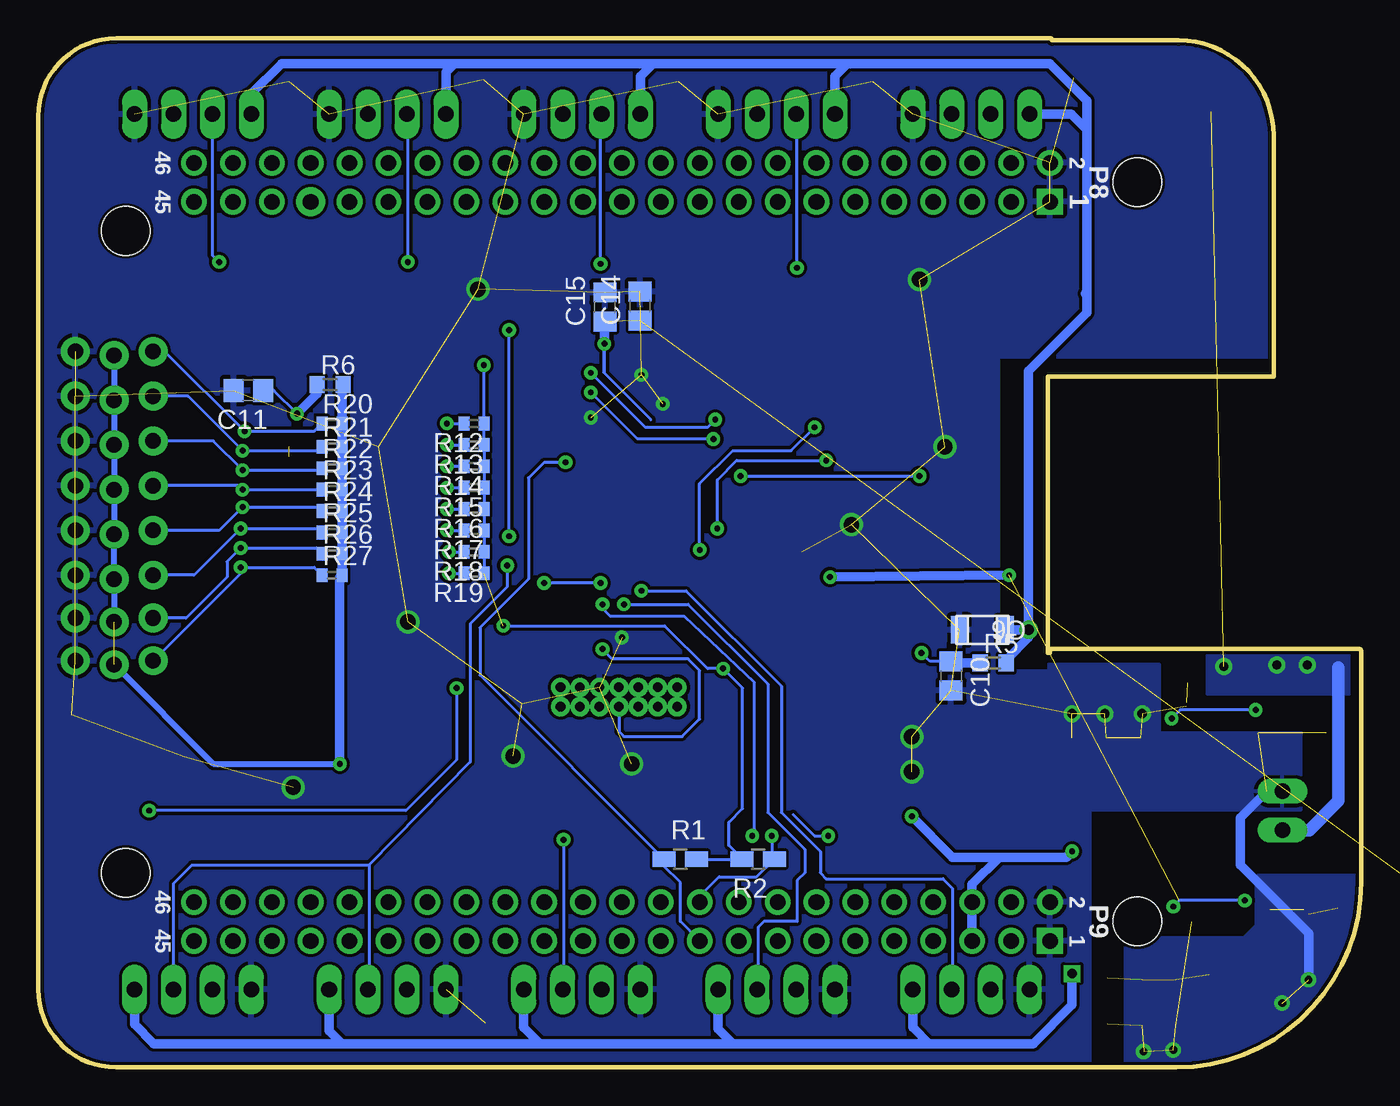
[diagram p6: board, bottom side, seen from below]

Size 86.36 x 67.18 mm. Coordinates in mm from the lower left corner, seen from the top.
Outline: 0.13,27.3 20.32,27.3 20.32,27.05 20.45,27.05 20.45,45.08 5.72,45.08 5.72,60.83 arc-90 11.94,67.06 20.19,67.06 arc-90 20.32,67.18 81.28,67.18 arc-90 86.36,62.1 86.36,5.08 arc-90 81.28,0 12.07,0 arc-90 0,12.07 0,27.18 arc-90 0.13,27.3
Copper layers (1*16): Top 0.035mm / dielectric 1.5mm / Bottom 0.035mm
Design rules "SparkFun *": minimum track width 8mil, minimum drill 15mil, track to track 8mil, track to pad 8mil, pad to pad 1mil, via to via 8mil, smd to smd 8mil, copper to edge 8mil, drill to drill 8mil, minimum pad ring 12mil, minimum via ring 10mil, stop-mask expansion 4mil, vias tented up to drill 25mil, thermal gap 10mil

### Footprints (pad centres in the part's own frame; a part is rotated, then mirrored left to right if it is on the bottom)
1X03_LOCK = drill 1.016 pad 1.88: 1 0,0.127; 2 2.54,-0.127; 3 5.08,0.127
1206 = smd 1.118 x 1.803: 1 -1.499,0; 2 1.499,0
C0805 = smd 1.3 x 1.5: 1 -0.95,0; 2 0.95,0
C0603 = smd 1.1 x 1: 1 -0.85,0; 2 0.85,0
C3216X7R1E335K = smd 1.118 x 1.803: 1 -1.499,0; 2 1.499,0
0402 = smd 0.559 x 0.61: 1 -0.419,0; 2 0.419,0
0603 = smd 0.66 x 0.965: 1 -0.699,0; 2 0.699,0
0805 = smd 1.118 x 1.448: 1 -0.902,0; 2 0.902,0
7395-04 = drill 1.016 long: 1 3.81,0; 2 1.27,0; 3 -1.27,0; 4 -3.81,0
7395-02 = drill 1.016 long: 1 1.27,0; 2 -1.27,0
EXTERNAL_DEBUG = drill 0.635 pad 0.737: 1 -2.54,-0.635; 2 -2.54,0.635; 3 -1.27,-0.635; 4 -1.27,0.635; 5 0,-0.635; 6 0,0.635; 7 1.27,-0.635; 9 2.54,-0.635; 10 2.54,0.635; 11 3.81,-0.635; 12 3.81,0.635; 13 5.08,-0.635; 14 5.08,0.635 | drill 0.635 pad 0.762: 8 1.27,0.635
IHLP-1212BZ = smd 1.753 x 0.711: 1 -1.079,0; 2 1.079,0
R0805W = smd 1.5 x 1: 1 -1.052,0; 2 1.052,0
CRCW0402100KFKED = smd 0.559 x 0.61: 1 -0.419,0; 2 0.419,0
R0603 = smd 1 x 1.1: 1 -0.85,0; 2 0.85,0
R0402 = smd 0.7 x 0.9: 1 -0.65,0; 2 0.65,0
TACTILE_SWITCH_TALL = smd 1.55 x 1.3: A1 -3.975,-2.25; A2 3.975,-2.25; B1 -3.975,2.25; B2 3.975,2.25
SOP65P640X120-24N = smd 1.473 x 0.356: 1 -2.921,3.581; 2 -2.921,2.921; 3 -2.921,2.286; 4 -2.921,1.626; 5 -2.921,0.965; 6 -2.921,0.33; 7 -2.921,-0.33; 8 -2.921,-0.965; 9 -2.921,-1.626; 10 -2.921,-2.286; 11 -2.921,-2.921; 12 -2.921,-3.581; 13 2.921,-3.581; 14 2.921,-2.921; 15 2.921,-2.286; 16 2.921,-1.626; 17 2.921,-0.965; 18 2.921,-0.33; 19 2.921,0.33; 20 2.921,0.965; 21 2.921,1.626; 22 2.921,2.286; 23 2.921,2.921; 24 2.921,3.581
S-PVQFN-N16 = smd 0.508 x 0.305: 1 -1.25,0.75; 2 -1.25,0.25; 3 -1.25,-0.25; 4 -1.25,-0.75; 9 1.25,-0.75; 10 1.25,-0.25; 11 1.25,0.25; 12 1.25,0.75 | smd 0.305 x 0.508: 5 -0.75,-1.25; 6 -0.25,-1.25; 7 0.25,-1.25; 8 0.75,-1.25; 13 0.75,1.25; 14 0.25,1.25; 15 -0.25,1.25; 16 -0.75,1.25 | smd 1.702 x 1.702: 17 0,0
SOP65P640X110-15N = smd 1.422 x 0.279: 1 -2.184,0.991; 2 -2.184,0.508; 3 -2.184,0; 4 -2.184,-0.508; 5 -2.184,-0.991; 6 2.184,-0.991; 7 2.184,-0.508; 8 2.184,0; 9 2.184,0.508; 10 2.184,0.991 | smd 1.727 x 2.184: 11 0,0
BEAGLE_BONE_BLACK_CAPE = drill 1.016 pad 1.676 square: P8.1 20.32,50.165; P9.1 20.32,1.905 | drill 1.016 pad 1.676: P8.2 20.32,52.705; P8.3 22.86,50.165; P8.4 22.86,52.705; P8.5 25.4,50.165; P8.6 25.4,52.705; P8.7 27.94,50.165; P8.8 27.94,52.705; P8.9 30.48,50.165; P8.10 30.48,52.705; P8.11 33.02,50.165; P8.12 33.02,52.705; P8.13 35.56,50.165; P8.14 35.56,52.705; P8.15 38.1,50.165; P8.16 38.1,52.705; P8.17 40.64,50.165; P8.18 40.64,52.705; P8.19 43.18,50.165; P8.20 43.18,52.705; P8.21 45.72,50.165; P8.22 45.72,52.705; P8.23 48.26,50.165; P8.24 48.26,52.705; P8.25 50.8,50.165; P8.26 50.8,52.705; P8.27 53.34,50.165; P8.28 53.34,52.705; P8.29 55.88,50.165; P8.30 55.88,52.705; P8.31 58.42,50.165; P8.32 58.42,52.705; P8.33 60.96,50.165; P8.34 60.96,52.705; P8.35 63.5,50.165; P8.36 63.5,52.705; P8.37 66.04,50.165; P8.38 66.04,52.705; P8.40 68.58,52.705; P8.41 71.12,50.165; P8.42 71.12,52.705; P8.43 73.66,50.165; P8.44 73.66,52.705; P8.45 76.2,50.165; P8.46 76.2,52.705; P9.2 20.32,4.445; P9.3 22.86,1.905; P9.4 22.86,4.445; P9.5 25.4,1.905; P9.6 25.4,4.445; P9.7 27.94,1.905; P9.8 27.94,4.445; P9.9 30.48,1.905; P9.10 30.48,4.445; P9.11 33.02,1.905; P9.12 33.02,4.445; P9.13 35.56,1.905; P9.14 35.56,4.445; P9.15 38.1,1.905; P9.16 38.1,4.445; P9.17 40.64,1.905; P9.18 40.64,4.445; P9.19 43.18,1.905; P9.20 43.18,4.445; P9.21 45.72,1.905; P9.22 45.72,4.445; P9.23 48.26,1.905; P9.24 48.26,4.445; P9.25 50.8,1.905; P9.26 50.8,4.445; P9.27 53.34,1.905; P9.28 53.34,4.445; P9.29 55.88,1.905; P9.30 55.88,4.445; P9.31 58.42,1.905; P9.32 58.42,4.445; P9.33 60.96,1.905; P9.34 60.96,4.445; P9.35 63.5,1.905; P9.36 63.5,4.445; P9.37 66.04,1.905; P9.38 66.04,4.445; P9.39 68.58,1.905; P9.40 68.58,4.445; P9.41 71.12,1.905; P9.42 71.12,4.445; P9.43 73.66,1.905; P9.44 73.66,4.445; P9.45 76.2,1.905; P9.46 76.2,4.445 | drill 1.016 pad 1.88: P8.39 68.58,50.165 | hole 3.175: 14.605,3.175; 80.645,6.35; 80.645,48.26; 14.605,51.435
QFN50P700X700X100-49N = smd 0.813 x 0.305: 1 -3.48,2.743; 2 -3.48,2.261; 3 -3.48,1.753; 4 -3.48,1.245; 5 -3.48,0.762; 6 -3.48,0.254; 7 -3.48,-0.254; 8 -3.48,-0.762; 9 -3.48,-1.245; 10 -3.48,-1.753; 11 -3.48,-2.261; 12 -3.48,-2.743; 25 3.48,-2.743; 26 3.48,-2.261; 27 3.48,-1.753; 28 3.48,-1.245; 29 3.48,-0.762; 30 3.48,-0.254; 31 3.48,0.254; 32 3.48,0.762; 33 3.48,1.245; 34 3.48,1.753; 35 3.48,2.261; 36 3.48,2.743 | smd 0.305 x 0.813: 13 -2.743,-3.48; 14 -2.261,-3.48; 15 -1.753,-3.48; 16 -1.245,-3.48; 17 -0.762,-3.48; 18 -0.254,-3.48; 19 0.254,-3.48; 20 0.762,-3.48; 21 1.245,-3.48; 22 1.753,-3.48; 23 2.261,-3.48; 24 2.743,-3.48; 37 2.743,3.48; 38 2.261,3.48; 39 1.753,3.48; 40 1.245,3.48; 41 0.762,3.48; 42 0.254,3.48; 43 -0.254,3.48; 44 -0.762,3.48; 45 -1.245,3.48; 46 -1.753,3.48; 47 -2.261,3.48; 48 -2.743,3.48 | smd 5.588 x 5.588: 49 0,0

### Placement (x,y rotation side)
AUX1  78.87,46.61 0 top
AUX2  78.87,43.69 0 top
AUX3  78.87,40.77 0 top
AUX4  78.87,37.85 0 top
AUX5  78.87,34.92 0 top
AUX6  78.87,32 0 top
AUX7  78.87,29.21 0 top
AUX8  78.87,26.42 0 top
C1  31.78,4.32 270 top
C2  57.2,4.42 270 top
C3  69.9,4.42 270 top
C4  44.4,4.32 270 top
C5  82.67,23.02 0 top
C6  24.73,28.57 180 bottom
C7  31.88,62.86 90 top
C8  44.58,62.86 90 top
C9  57.28,62.99 90 top
C10  26.77,25.55 270 bottom
C11  72.64,44.2 180 bottom
C13  69.98,62.86 90 top
C14  47.08,49.71 90 bottom
C15  49.38,49.64 90 bottom
C16  54.79,24.56 270 top
C17  18.8,63.12 90 top
C18  82.75,4.65 270 top
C19  14.43,20 90 top
C20  16.65,20 90 top
C21  18.88,20 90 top
C22  4.51,23.34 270 top
C23  2.29,23.34 270 top
C24  6.73,23.34 270 top
C25  10.94,25.08 0 top
C26  16.58,4.34 270 top
C27  14.34,4.24 270 top
C28  12.09,4.21 270 top
C29  5.97,11.83 270 top
C30  1.53,11.88 270 top
C31  3.75,11.8 270 top
C32  7.92,13.93 90 top
C33  11.36,13.56 90 top
J1  25.46,62.23 180 top
J2  38.16,62.23 180 top
J3  50.86,62.23 180 top
J4  63.56,62.23 180 top
J5  76.26,62.23 180 top
J6  76.26,5.08 0 top
J7  63.56,5.08 0 top
J8  50.86,5.08 0 top
J9  38.16,5.08 0 top
J10  25.46,5.08 0 top
J11  5.14,16.75 270 top
J12  47.19,24.18 0 top
L1  9.99,18.41 0 top
L2  8.83,6.05 0 top
R1  44.45,13.59 0 bottom
R2  39.37,13.59 180 bottom
R3  12.32,20.88 90 top
R4  11.7,8.03 180 top
R5  24.03,26.39 0 bottom
R6  67.31,44.58 0 bottom
R7  55.3,27.38 0 top
R8  51.89,27.36 0 top
R9  41.66,23.55 180 top
R12  57.91,42.04 180 bottom
R13  57.91,40.64 180 bottom
R14  57.91,39.24 180 bottom
R15  57.91,37.85 180 bottom
R16  57.91,36.45 180 bottom
R17  57.91,35.05 180 bottom
R18  57.91,33.66 180 bottom
R19  57.91,32.26 180 bottom
R20  67.18,42.04 0 bottom
R21  67.18,40.51 0 bottom
R22  67.18,39.12 0 bottom
R23  67.18,37.72 0 bottom
R24  67.18,36.32 0 bottom
R25  67.18,34.92 0 bottom
R26  67.18,33.53 0 bottom
R27  67.18,32.13 0 bottom
S1  80.82,18.01 180 top
U1  67.06,36.96 0 top
U2  9.67,22.54 90 top
U3  9.82,10.25 90 top
U4  33.58,37.26 180 top
U5  10.29,60.2 270 top
U$1  0,6.35 0 top
U$2  126.67,20.09 90 top  (outside the outline)
U$3  -17.4,0.38 0 top  (outside the outline)

### Tracks (layer width: path | path; a pad name or v marks a point on that pad's centre or on a via)
+3V3  (via drill 0.38)  (5 unrouted)
  Top 0.203: U3.14 7.99,10.5 v7.6,10.9 | U3.7 11.19,10.49 v12.27,10.49 12.27,8.18 R4.1 | 12.09,8.05 R4.1 | R4.1 12.09,8.03 C28.1 | 56.26,27.27 R7.2 56.01,27.52 v56.01,28.83 | R9.2 40.81,25.19 | 49.41,47.23 v49.4,47.24 55.88,47.24 v57.28,45.85 63.25,39.88 U1.2 | U4.2 34.98,34.34 34.67,34.04 v34.67,32 | v41.66,26.04 40.64,26.04 40.45,26.23
  Top 0.61: R9.2 40.81,25.87 40.45,26.23 v34.67,32
  Bottom 0.203: v7.6,10.9 11.86,10.9 v12.27,10.49 | v41.66,26.04 42.67,26.04 45.47,28.83 v56.01,28.83 | 49.41,45.34 49.41,47.23 v49.4,47.24 49.4,45.33 46.37,42.29 | R19.1 R18.1 R17.1 R16.1 R15.1 R14.1 R13.1 R12.1 57.26,45.83 v57.28,45.85 | 40.42,24.8 v41.66,26.04 | R1.2 R2.2 40.42,13.62 41.28,14.48 41.28,16 40.39,16.89 40.39,24.77 v41.66,26.04
  Bottom 0.61: v34.67,32 v22.99,32.13 | 49.4,48.67 v49.4,47.24
  pour Top: 17.78,4.57 17.78,7.24 9.14,7.24 9.14,4.57
+5V  (via drill 0.38, 0.6, 0.7)  (1 unrouted)
  Top 0.203: U2.7 10.93,22.78 v12.37,22.78 12.37,22.54 13.06,21.75 13.06,19.61 | 12.61,17.78 12.61,18.26 | U2.14 7.43,22.79 v6.89,23.34 | R3.1 12.32,19.33 12.61,19.05
  Top 0.406: AUX8.2 81.17,26.05 C5.1
  Top 0.61: v18.87,6.12 v18.87,14.1 | v18.87,14.1 18.87,16.76 | 18.87,16.76 18.87,17.09 | C1.1 30.01,5.82 J10.1 | C4.1 42.71,5.82 J9.1 | C2.1 55.51,5.92 J8.1 | C3.1 68.21,5.92 J7.1 | C18.1 81.14,6.14 J6.1 | 18.87,16.76 19.25,17.14 21.34,17.14 21.72,17.53 v21.72,28.57 | C7.1 33.49,61.37 J2.1 | C8.1 46.19,61.37 J3.1 | C9.1 59.02,61.49 J4.1 | C13.1 71.59,61.37 J5.1 | C17.1 21.04,61.62 J1.1 | 18.87,16.76 18.92,16.71 18.87,16.66 v18.87,14.1 | v29.34,16.38 63.25,16.38 v66.67,19.81
  Bottom 0.203: v6.89,23.34 11.81,23.34 v12.37,22.78
  Bottom 0.406: AUX1.2 AUX2.2 AUX3.2 AUX4.2 AUX5.2 AUX6.2 AUX7.2 | AUX8.2 74.93,19.81 v66.67,19.81
  Bottom 0.61: J6.1 80.07,2.81 78.82,1.55 66.52,1.55 | 66.52,1.55 53.62,1.55 | 53.62,1.55 41.02,1.55 | 41.02,1.55 28.22,1.55 | 28.22,1.55 21.41,1.55 18.87,4.09 v18.87,6.12 | J10.1 29.27,2.6 28.22,1.55 | J9.1 41.97,2.5 41.02,1.55 | J8.1 54.67,2.6 53.62,1.55 | J7.1 67.37,2.4 66.52,1.55 | J5.1 72.45,63.56 70.48,65.53 59.18,65.53 | 59.18,65.53 46.23,65.53 | 46.23,65.53 33.53,65.53 | 33.53,65.53 20.32,65.53 17.91,63.12 17.91,61.21 | 17.91,61.21 17.91,50.42 | 17.91,50.42 17.91,49.28 21.72,45.47 v21.72,28.57 | J1.1 18.92,62.23 17.91,61.21 | J2.1 34.35,64.71 33.53,65.53 | J3.1 47.05,64.71 46.23,65.53 | J4.1 59.75,64.96 59.18,65.53 | 18,50.51 17.91,50.42 | C6.1 v21.73,28.57 v21.72,28.57 | v21.72,28.57 21.72,28.07 23.18,26.61 R5.2 | U$1.P9.5 U$1.P9.6 25.4,11.94 23.62,13.72 | 23.62,13.72 19.25,13.72 v18.87,14.1 | 23.62,13.72 26.67,13.72 v29.34,16.38 | R6.2 66.53,44.5 R20.2 R21.2 R22.2 R23.2 R24.2 R25.2 R26.2 R27.2 66.67,31.99 v66.67,19.81
  pour Top: 10.22,19.84 20.15,19.84 20.15,16.67 10.22,16.67
DVCC  (3 unrouted)
ECHO1
  Top 0.203: 36.56,37.53 U4.7
ECHO2
  Top 0.203: 37.66,37.03 37.59,36.96 36.53,36.96 U4.6
ECHO3
  Top 0.203: 38.05,36.53 37.85,36.32 36.53,36.32 U4.5
ECHO4
  Top 0.203: 38.44,36.03 37.97,35.56 36.58,35.56 U4.4
ECHO5
  Top 0.203: 36.55,35.03 U4.3 36.55,34.92 37.97,34.92 38.61,34.29 42.55,34.29 43.28,35.03
ECHO6
  Top 0.203: 46.41,43.76 45.21,44.96 40.89,44.96 39.62,43.69 39.62,39.24 38.61,38.23 U4.8
ECHO7
  Top 0.203: 46.91,44.02 45.34,45.59 40.64,45.59 39.12,44.07 39.12,39.62 38.35,38.86 36.53,38.86 U4.9
ECHO8
  Top 0.203: 47.91,45.43 47.24,46.1 40.39,46.1 38.61,44.32 38.61,40 38.1,39.5 36.55,39.5 U4.10
ECHO9
  Top 0.203: U4.11 37.64,40.18 38.1,40.64 38.1,44.58 40.13,46.61 47.75,46.61 48.41,45.95
ECHO10
  Top 0.203: 48.91,46.08 48.01,47.12 40.01,47.12 36.45,43.56 36.45,40.89 U4.12
GND  (via drill 0.38, 0.5, 0.6, 1)  (64 unrouted)
  Top 0.203: U2.17 10.3,23.18 10.3,23.26 10.34,23.29 U2.8 11.13,23.29 11.41,23.57 11.41,23.81 | 10.14,22.3 10.07,22.23 10.07,21.83 10.1,21.79 U2.5 | U2.15 7.19,22.29 C24.2 | U3.17 9.68,10 U3.15 7.78,10 7.75,10.03 | U3.6 10.44,10 | 10.44,10 10.18,10 U3.17 | 6.3,10 C29.2 | U3.5 10.47,9.5 10.44,9.47 10.44,10 | U3.17 9.82,10.33 | U3.8 10.75,11 10.67,10.92 10.41,10.92 10.29,10.79 10.29,10.72 U3.17
  Top 0.254: U2.15 8.95,22.29 | 8.95,22.29 8.95,22.3 | U2.6 10.14,22.29 10.14,22.3 9.67,22.3 U2.17 9.67,22.29 8.95,22.29
  Top 0.406: 7.75,10.03 6.78,10.03
  Top 0.61: C29.2 6.52,9.78 6.78,10.03 | J11.2 6.16,18.02 7.92,16.26 C32.2 8.08,14.46 C33.2 | J10.4 21.65,1.99 21.21,1.55 17.87,1.55 C26.2 | J10.4 21.65,1.89 21.31,1.55 31.88,1.55 | 31.88,1.55 33.1,1.55 | 33.1,1.55 44.27,1.55 | 44.27,1.55 46.2,1.55 | 46.2,1.55 57.38,1.55 | 57.38,1.55 70.18,1.55 | 70.18,1.55 71.81,1.55 71.96,1.7 | 71.96,1.7 72.42,2.16 72.42,5.04 J6.4 | J9.4 34.35,2.81 33.1,1.55 | J8.4 47.05,2.4 46.2,1.55 | C31.2 3.43,9.98 v3.43,5.71 | C1.2 31.78,1.65 31.88,1.55 | C4.2 44.4,1.68 44.27,1.55 | C2.2 57.2,1.73 57.38,1.55 | C3.2 69.9,1.83 70.18,1.55 | J10.4 21.65,6.92 U$1.P9.1 U$1.P9.2 | C18.2 82.75,2.33 81.97,1.55 72.11,1.55 71.96,1.7
  Bottom 0.61: J11.2 6.16,18.02 7.9,16.28 7.9,13.23 3.43,8.76 v3.43,5.71
  other vias: 14.3,23.09 16.74,23.09 18.87,23.09 5.16,4.19 12.27,1.14 14.2,1.04 46.99,45.21 50.29,42.42 45.59,43.31 55.37,20.32 48.26,28.07 29.34,21.59 29.34,19.3 47.62,19.81 33.27,35.43 27.18,40.51 28.83,51.43 57.66,50.8 62.23,29.08 69.72,18.29
  pour Top: -0.33,22.46 7.76,22.46 7.68,17.07 -0.41,17.07
  pour Top: 20.78,20.64 13.24,20.64 13.24,23.57 11.18,23.57 11.18,26.42 20.78,26.42
  pour Bottom: 3.94,16.79 20.4,16.79 20.4,26.34 13.18,26.34 13.18,21.87 3.94,21.87
  pour Top: 6.88,11.2 0.58,11.2 0.58,9.88 0.58,9.78 2.31,8.05 6.68,8.05 6.78,8.05 6.88,8.05
  pour Top: 2.11,7.85 2.11,1.14 2.11,-0.28 19.89,-0.28 19.89,3.89 6.88,3.89 6.17,4.6 6.17,7.95 2.11,7.95
  pour Bottom: -0.03,12.52 6.78,12.52 6.88,12.42 6.88,9.27 7.7,8.46 15.32,8.46 15.42,8.36 15.42,-1.5 -0.74,-1.5 -0.74,12.52
  pour Top: 17.78,67.06 86.36,67.06 86.36,0 18.54,0 18.54,8.89 18.54,16 22.86,16 22.86,17.91 22.86,46.48 21.84,46.48 5.84,46.48 5.84,65.15 5.84,67.06
  pour Bottom: 5.21,67.44 86.61,67.44 86.61,-1.91 17.78,-1.91 17.78,25.78 23.75,25.78 23.75,31.75 23.75,46.48 4.45,46.48 4.45,67.44
N$2
  Top 0.203: U3.1 9.07,8.31 9.02,8.25
  Top 0.61: 9.02,8.25 8.61,8.25 7.8,7.44 7.8,6.09 L2.1
N$4  (via drill 0.38)  (1 unrouted)
  Top 0.203: U1.24 69.98,42.16 v69.47,42.67
  Bottom 0.203: C11.1 70.99,44.2 v69.47,42.67
  Bottom 0.61: R6.1 68.16,43.98 v69.47,42.67
N$5
  Top 0.203: U2.1 8.92,20.44 8.87,20.4
  Top 0.61: 8.87,20.4 8.87,19.08 L1.1
N$7
  Top 0.203: U2.9 10.42,24.98 C25.1
N$8
  Top 0.203: J12.12 51,27.32 R8.1
N$9
  Top 0.203: R9.1 J12.1
N$12  (via drill 0.38)
  Top 0.203: U4.23 U4.24 30.63,33.66 28.96,33.66 28.7,33.4 v28.7,27.05
  Bottom 0.203: C10.1 28.15,26.5 v28.7,27.05
  Bottom 0.61: R5.1 26.66,26.39 C10.1
N$14
  Top 0.203: R3.2 U2.4
N$15
  Top 0.203: R4.2 11.28,8.29 U3.4
N$20
  Top 0.203: U3.9 10.68,11.97 C33.1
PWM_C1  (via drill 0.38)
  Top 0.203: U1.3 62.48,39.24 v59.69,42.04 56.39,45.34 v50.29,45.34 | 44.81,39.64 v42.16,42.29
  Bottom 0.203: v59.69,42.04 R12.2 | v42.16,42.29 42.67,41.78 46.74,41.78 v50.29,45.34
PWM_C2  (via drill 0.38)
  Top 0.203: U1.4 61.75,38.58 v59.69,40.64 56.26,44.07 v50.29,44.07 | 43.64,38.53 42.29,39.88 v42.29,41.02
  Bottom 0.203: v59.69,40.64 R13.2 | 50.17,44.07 v50.29,44.07 47.24,41.02 v42.29,41.02
PWM_C3  (via drill 0.38)
  Top 0.203: U1.5 61.01,37.92 v59.69,39.24 57.98,37.53
  Bottom 0.203: v59.69,39.24 R14.2
PWM_C4  (via drill 0.38)
  Top 0.203: U1.6 60.25,37.29 v59.69,37.85 58.87,37.03
  Bottom 0.203: v59.69,37.85 R15.2
PWM_C5  (via drill 0.38)
  Top 0.203: U1.7 59.87,36.63 v59.69,36.45 59.61,36.53
  Bottom 0.203: v59.69,36.45 R16.2
PWM_C6  (via drill 0.38)
  Top 0.203: U1.8 60.63,35.99 v59.69,35.05 58.71,36.03
  Bottom 0.203: v59.69,35.05 R17.2
PWM_C7  (via drill 0.38)
  Top 0.203: U1.9 61.24,35.33 v59.56,33.66 57.69,35.53
  Bottom 0.203: v59.56,33.66 R18.2
PWM_C8  (via drill 0.38)
  Top 0.203: U1.10 61.98,34.67 v59.56,32.26 58.93,31.62 v53.34,31.62 | 48.91,32.37 v49.66,31.62
  Bottom 0.203: v59.56,32.26 R19.2 | v49.66,31.62 v53.34,31.62
PWM_IN_1  (via drill 0.38)
  Top 0.203: U1.22 71.25,39.24 71.63,39.62 71.63,40.26 v72.9,41.53
  Bottom 0.203: R20.1 68.34,41.53 v72.9,41.53 78.11,46.74 AUX1.1
PWM_IN_2  (via drill 0.38)
  Top 0.203: U1.21 71.35,38.58 v73.03,40.26
  Bottom 0.203: R21.1 68.09,40.26 v73.03,40.26 76.58,43.81 AUX2.1
PWM_IN_3  (via drill 0.38)
  Top 0.203: U1.20 71.96,37.92 v73.03,38.99
  Bottom 0.203: R22.1 67.96,38.99 v73.03,38.99 74.93,40.89 AUX3.1
PWM_IN_4  (via drill 0.38)
  Top 0.203: U1.19 72.59,37.29 v73.03,37.72
  Bottom 0.203: R23.1 v73.03,37.72 73.28,37.97 AUX4.1
PWM_OUT_1  (via drill 0.38)
  Top 0.203: U1.18 72.97,36.63 v73.03,36.58
  Bottom 0.203: R24.1 68.09,36.58 v73.03,36.58 74.55,35.05 AUX5.1
PWM_OUT_2  (via drill 0.38)
  Top 0.203: U1.17 72.34,35.99 v73.15,35.18
  Bottom 0.203: R25.1 68.09,35.18 v73.15,35.18 76.2,32.13 AUX6.1
PWM_OUT_3  (via drill 0.38)
  Top 0.203: U1.16 71.73,35.33 v73.15,33.91
  Bottom 0.203: R26.1 68.21,33.91 v73.15,33.91 74.04,33.02 74.04,32 76.71,29.34 AUX7.1
PWM_OUT_4  (via drill 0.38)
  Top 0.203: U1.15 71.12,34.67 v73.15,32.64
  Bottom 0.203: R27.1 68.34,32.64 v73.15,32.64 73.15,32.26 AUX8.1
RESET  (via drill 0.38)
  Top 0.203: 52.74,31.1 R8.2 54.42,27.36 R7.1 54.45,25.75 C16.1 58.41,25.41 v59.06,24.77 | S1.B2 77.85,16.76 v79.12,16.76
  Bottom 0.203: v59.06,24.77 59.06,20.07 62.36,16.76 v79.12,16.76
SCL  (via drill 0.38)
  Top 0.203: 51.36,38.53 51.94,39.12 v51.94,39.5
  Bottom 0.203: U$1.P9.19 44.45,9.52 44.45,12.07 45.5,13.12 R1.1 57.53,25.62 57.53,28.7 54.36,31.88 54.36,38.48 53.34,39.5 v51.94,39.5
SDA  (via drill 0.38)
  Top 0.203: v34.8,15.11 v38.48,15.11
  Bottom 0.203: U$1.P9.20 43.18,11.18 41.91,12.45 39.46,12.45 R2.1 38.48,13.75 v38.48,15.11 | 37.08,16.51 35.69,15.11 v34.8,15.11
TCK
  Top 0.203: 46.91,32.18 46.1,31.37 46.1,28.83 48.51,26.42 48.51,24.87 J12.8
TDI
  Top 0.203: 45.91,32.7 44.83,31.62 44.83,27.69 45.85,26.67 45.85,24.89 J12.4
TDO
  Top 0.203: 45.41,32.97 44.32,31.88 44.32,25.15 J12.2
TEST  (via drill 0.38)
  Top 0.203: v49.53,27.3 49.41,27.42 49.41,28.71 50.55,29.85 50.55,31.88 49.4,33.02 49.4,33.92
  Bottom 0.203: J12.7 48.46,21.92 48.13,21.59 44.32,21.59 43.18,22.73 43.18,25.91 43.94,26.67 48.89,26.67 v49.53,27.3
TMS
  Top 0.203: 46.41,32.44 45.47,31.5 45.47,28.32 47.12,26.67 47.12,24.89 J12.6
TRIG_J1  (via drill 0.38)
  Top 0.203: v28.83,38.61 28.83,46.1 30.99,48.26 30.99,52.58 29.34,54.23 24.64,54.23 24.13,54.74 24.13,62.17 J1.2 | 41.09,38.03 v40.51,38.61
  Bottom 0.203: v40.51,38.61 v28.83,38.61
TRIG_J2  (via drill 0.38)
  Top 0.203: 42.39,35.53 v42.04,35.18 | v34.92,39.62 34.92,50.29 v36.83,52.2
  Bottom 0.203: v36.83,52.2 36.83,62.17 J2.2 | v42.04,35.18 42.04,38.35 40.77,39.62 v34.92,39.62
TRIG_J3  (via drill 0.38)
  Top 0.203: 43.93,34.53 v43.18,33.78 | v35.69,41.78 35.69,49.66 38.48,52.45 v49.66,52.45
  Bottom 0.203: v43.18,33.78 43.18,38.1 41.02,40.26 37.21,40.26 v35.69,41.78 | v49.66,52.45 49.66,62.17 J3.2
TRIG_J4  (via drill 0.38)
  Top 0.203: 55.27,35.03 v55.63,34.67 | v55.63,48.13 55.63,51.82 56.39,52.58 v62.23,52.58 v74.55,52.58
  Bottom 0.203: v55.63,34.67 v55.63,48.13 | v62.23,52.58 62.23,62.17 J4.2 | J5.2 74.99,53.02 v74.55,52.58
TRIG_J6  (via drill 0.38)
  Top 0.203: 53.99,34.53 v55.75,32.77
  Bottom 0.203: v55.75,32.77 55.75,31.37 58.17,28.96 58.17,19.94 64.77,13.21 | 64.77,13.21 64.77,5.14 J7.2 | J6.2 77.53,12 76.33,13.21 64.77,13.21
TRIG_J8  (via drill 0.38)
  Top 0.203: 48.41,31.34 v49.53,30.23 | v39.75,15.11 51.82,15.11 v52.07,14.86
  Bottom 0.203: v49.53,30.23 49.53,29.97 49.02,29.46 44.2,29.46 39.62,25.15 39.62,15.24 v39.75,15.11 | v52.07,14.86 52.07,5.14 J8.2
TRIG_J9  (via drill 0.38)
  Top 0.203: 47.91,30.45 v48.13,30.23
  Bottom 0.203: v48.13,30.23 43.94,30.23 38.73,25.02 38.73,16.64 36.32,14.22 36.32,12.7 36.83,12.19 36.83,9.52 38.99,9.52 39.37,9.14 39.37,5.14 J9.2
TRIG_J10  (via drill 0.38)
  Top 0.203: 47.41,31.54 v46.99,31.12
  Bottom 0.203: v46.99,31.12 44.07,31.12 37.85,24.89 37.85,16.64 35.31,14.1 35.31,12.7 34.92,12.32 27.31,12.32 26.67,11.68 26.67,5.14 J10.2
VCC  (via drill 0.6)  (1 unrouted)
  Top 0.203: 8.4,23.31 U2.13 | 8.3,23.41 U2.13 | U2.11 9.42,24.52 9.43,24.53 9.92,24.04 U2.10 | U2.13 8.42,24.47 8.48,24.53 | U3.11 9.55,12.67 9.73,12.73 | U3.10 10.05,12.56 10.24,12.62 | U3.13 8.56,11 8.13,11.43 8.13,12.32
  Top 0.254: U2.11
  Bottom 0.813: J11.1 3.4,15.48 1.49,17.38 1.49,26.11
  other vias: 3.52,26.27 5.51,26.27 8.97,26.17
  pour Top: 0.86,24.13 7.37,24.13 7.37,24.37 9.99,24.37 9.91,26.99 0.86,26.99
  pour Bottom: 10.06,24.37 0.78,24.37 0.78,26.91 10.06,26.91
  pour Top: 0.38,16.38 5.97,16.38 7.09,15.27 7.09,12.01 0.08,12.01 0.08,16.38
  pour Top: 7.19,12.22 10.24,12.22 10.24,12.93 9.63,13.54 6.88,13.54 6.88,12.22
X1
  Top 0.203: U4.13 30.66,46.79 31.5,47.62 31.5,52.83 29.46,54.86 27.18,54.86 26.67,55.37 26.67,62.17 J1.3
X2
  Top 0.203: U4.14 31.8,40.18 32,40.39 32,53.59 33.4,54.99 38.61,54.99 39.37,55.75 39.37,62.17 J2.3
X3
  Top 0.203: U4.15 32.06,39.55 32.64,40.13 32.64,53.34 33.66,54.36 50.93,54.36 52.07,55.5 52.07,62.17 J3.3
X4
  Top 0.203: U4.16 32.16,38.89 33.27,40 33.27,53.21 33.91,53.85 63.63,53.85 64.77,54.99 64.77,62.17 J4.3
X5
  Top 0.203: U4.17 32.26,38.23 33.91,39.88 33.91,52.96 34.29,53.34 76.58,53.34 77.6,54.36 77.6,62.17 J5.3
X6
  Top 0.203: U4.22 28.12,34.98 27.69,34.54 27.69,15.11 28.7,14.1 72.52,14.1 74.93,11.81 74.93,5.14 J6.3
X7
  Top 0.203: U4.21 27.64,35.64 27.18,35.18 27.18,14.73 28.45,13.46 60.45,13.46 62.23,11.68 62.23,5.14 J7.3
X8
  Top 0.203: U4.20 27.15,36.3 26.54,35.69 26.54,14.48 28.07,12.95 48.77,12.95 49.53,12.19 49.53,5.14 J8.3
X9
  Top 0.203: U4.19 26.52,36.93 26.03,36.45 26.03,14.1 27.69,12.45 36.45,12.45 36.83,12.07 36.83,5.14 J9.3
X10
  Top 0.203: U4.18 26.42,37.59 25.53,36.7 25.53,13.72 24.13,12.32 24.13,5.14 J10.3

### Text on the board
tNames: Range Cape